# EAGLE design SensorBoard (EAGLE 9.6.2)

## Sheet 1 of 3
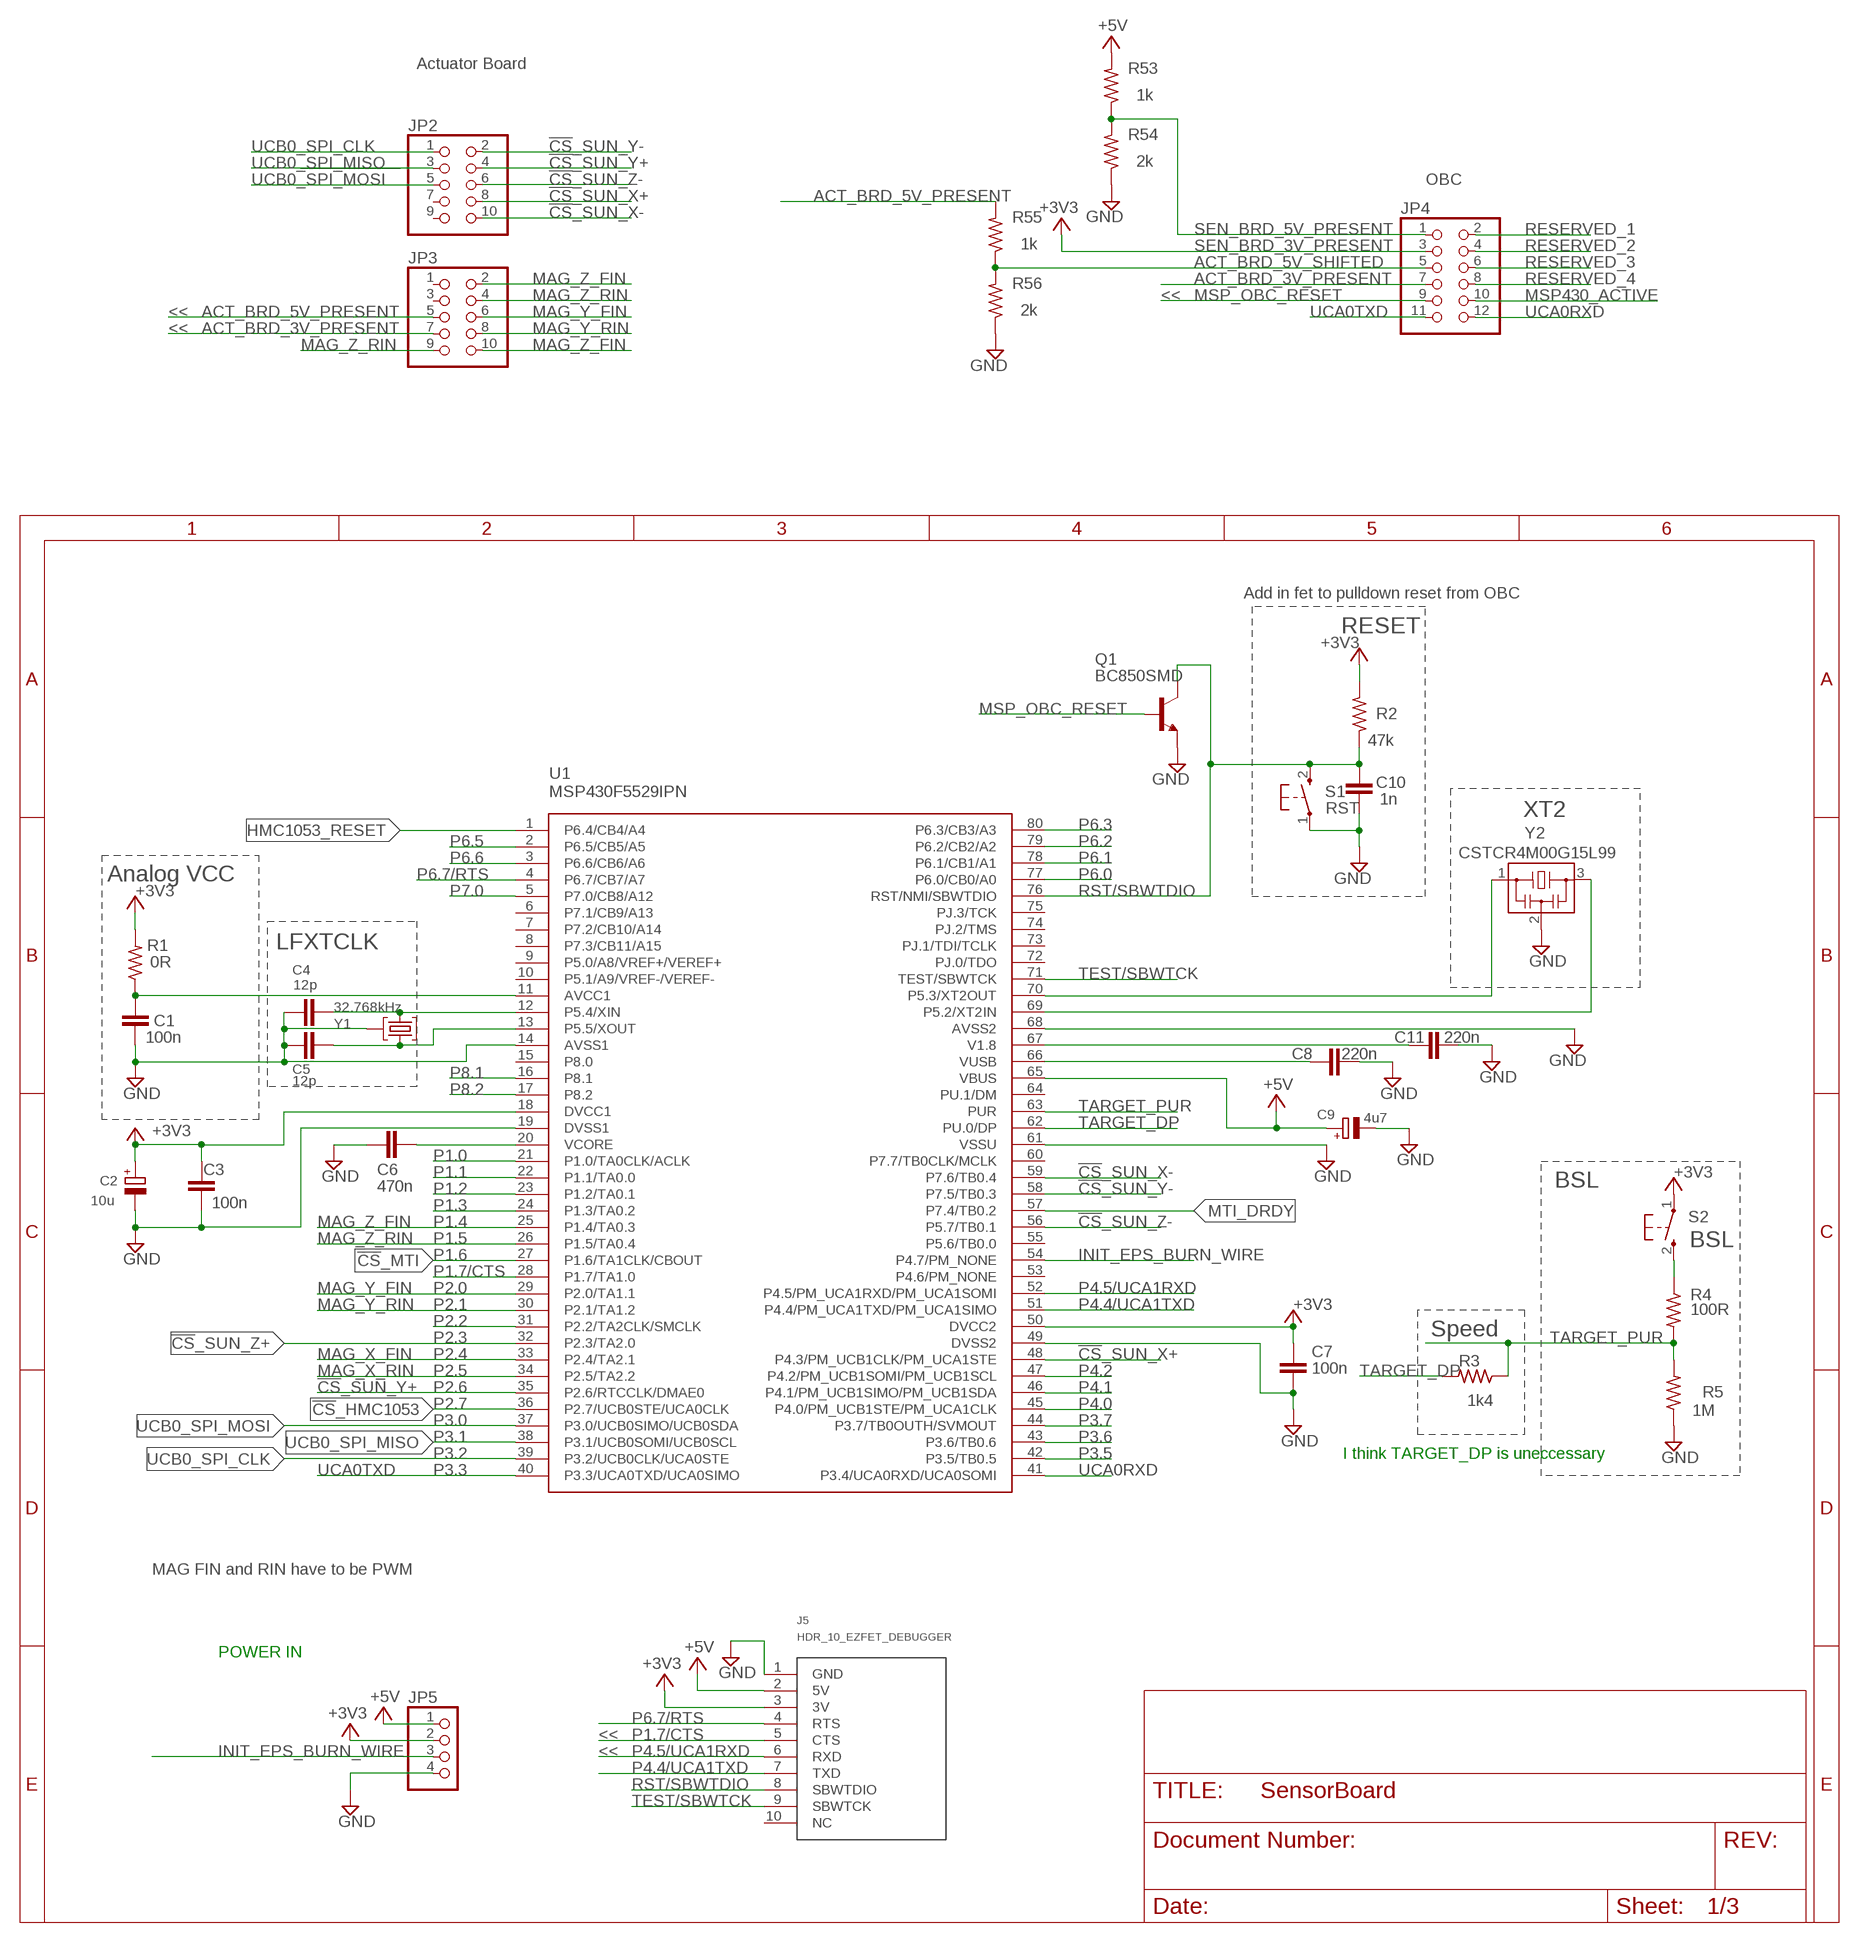
[diagram p0: schematic, sheet 1]

### Parts
C1  100n  C-EUC0402  [C0402]
C2  10u  CPOL-EUA/3216-18R  [A/3216-18R]
C3  100n  C-EUC0402  [C0402]
C4  12p  C-EUC0402  [C0402]
C5  12p  C-EUC0402  [C0402]
C6  470n  C-EUC0402  [C0402]
C7  100n  C-EUC0402  [C0402]
C8  220n  C-EUC0402  [C0402]
C9  4u7  CPOL-EUA/3216-18R  [A/3216-18R]
C10  1n  C-EUC0402  [C0402]
C11  220n  C-EUC0402  [C0402]
J5  HDR_10_EZFET_DEBUGGER  [HDRV10W66P254_10X1_2540X254H858]
JP2  PINHD-2X5  [2X05]
JP3  PINHD-2X5  [2X05]
JP4  PINHD-2X6  [2X06]
JP5  PINHD-1X4  [1X04]
Q1  BC850SMD  [SOT23-BEC]
R1  0R  R-US_R0402  [R0402]
R2  47k  R-US_R0402  [R0402]
R3  1k4  R-US_R0402  [R0402]
R4  100R  R-US_R0402  [R0402]
R5  1M  R-US_R0402  [R0402]
R53  1k  R-US_R0402  [R0402]
R54  2k  R-US_R0402  [R0402]
R55  1k  R-US_R0402  [R0402]
R56  2k  R-US_R0402  [R0402]
S1  RST  PB  [PBTH]
S2  BSL  PB  [PBTH]
U1  MSP430F5529IPN  [QFP80P50_1400X1400X160L60X22N]
Y1  32.768kHz  MS3V-T1R  [MS3V-T1R]
Y2  CSTCR4M00G15L99  CSTCR4M00G15L996M00G53Z  [MURATA-FILTER_CSTCR]

### Nets
!CS!_HMC1053: U1.36(P2.7/UCB0STE/UCA0CLK) ; also sheet 2
!CS!_MTI: U1.27(P1.6/TA1CLK/CBOUT) ; also sheet 3
!CS!_SUN_X+: JP2.10 U1.48(P4.3/PM_UCB1CLK/PM_UCA1STE)
!CS!_SUN_X-: JP2.8 U1.59(P7.6/TB0.4)
!CS!_SUN_Y+: JP2.4 U1.35(P2.6/RTCCLK/DMAE0)
!CS!_SUN_Y-: JP2.2 U1.58(P7.5/TB0.3)
!CS!_SUN_Z+: U1.32(P2.3/TA2.0)
!CS!_SUN_Z-: JP2.6 U1.56(P5.7/TB0.1)
+3V3: C2.+ C3.2 C7.1 J5.3(3V) JP4.3 JP5.2 R1.2 R2.2 S2.1(P) U1.18(DVCC1) U1.50(DVCC2) ; also sheet 2,3
+5V: C9.+ J5.2(5V) JP5.1 R53.2 U1.65(VBUS) ; also sheet 3
ACT_BRD_3V_PRESENT: JP3.7 JP4.7
ACT_BRD_5V_PRESENT: JP3.5 R55.2
ACT_BRD_5V_SHIFTED: JP4.5 R55.1 R56.2
AVCC1 [Power]: C1.1 R1.1 U1.11(AVCC1)
GND: C1.2 C2.- C3.1 C4.1 C5.1 C6.1 C7.2 C8.2 C9.- C10.2 C11.2 J5.1(GND) JP5.4 Q1.E R5.1 R54.1 R56.1 S1.1(P) U1.14(AVSS1) U1.19(DVSS1) U1.49(DVSS2) U1.61(VSSU) U1.68(AVSS2) Y1.P3(GND) Y2.2 ; also sheet 2,3
HMC1053_RESET: U1.1(P6.4/CB4/A4) ; also sheet 2
INIT_EPS_BURN_WIRE: JP5.3 U1.54(P4.7/PM_NONE)
MAG_X_FIN: U1.33(P2.4/TA2.1)
MAG_X_RIN: U1.34(P2.5/TA2.2)
MAG_Y_FIN: JP3.6 U1.29(P2.0/TA1.1)
MAG_Y_RIN: JP3.8 U1.30(P2.1/TA1.2)
MAG_Z_FIN: JP3.2 JP3.10 U1.25(P1.4/TA0.3)
MAG_Z_RIN: JP3.4 JP3.9 U1.26(P1.5/TA0.4)
MSP430_ACTIVE: JP4.10
MSP_OBC_RESET: JP4.9
MTI_DRDY: U1.57(P7.4/TB0.2) ; also sheet 3
N$1: Q1.B
N$12: R4.1 S2.2(S)
P1.0: U1.21(P1.0/TA0CLK/ACLK)
P1.1: U1.22(P1.1/TA0.0)
P1.2: U1.23(P1.2/TA0.1)
P1.3: U1.24(P1.3/TA0.2)
P1.7/CTS: J5.5(CTS) U1.28(P1.7/TA1.0)
P2.2: U1.31(P2.2/TA2CLK/SMCLK)
P3.5: U1.42(P3.5/TB0.5)
P3.6: U1.43(P3.6/TB0.6)
P3.7: U1.44(P3.7/TB0OUTH/SVMOUT)
P4.0: U1.45(P4.0/PM_UCB1STE/PM_UCA1CLK)
P4.1: U1.46(P4.1/PM_UCB1SIMO/PM_UCB1SDA)
P4.2: U1.47(P4.2/PM_UCB1SOMI/PM_UCB1SCL)
P4.4/UCA1TXD: J5.7(TXD) U1.51(P4.4/PM_UCA1TXD/PM_UCA1SIMO)
P4.5/UCA1RXD: J5.6(RXD) U1.52(P4.5/PM_UCA1RXD/PM_UCA1SOMI)
P5.2/XT2IN1: U1.69(P5.2/XT2IN) Y2.3
P5.3/XT2OUT1: U1.70(P5.3/XT2OUT) Y2.1
P5.4/XIN1: C4.2 U1.12(P5.4/XIN) Y1.P2
P5.5/XOUT1: C5.2 U1.13(P5.5/XOUT) Y1.P1
P6.0: U1.77(P6.0/CB0/A0)
P6.1: U1.78(P6.1/CB1/A1)
P6.2: U1.79(P6.2/CB2/A2)
P6.3: U1.80(P6.3/CB3/A3)
P6.5: U1.2(P6.5/CB5/A5)
P6.6: U1.3(P6.6/CB6/A6)
P6.7/RTS: J5.4(RTS) U1.4(P6.7/CB7/A7)
P7.0: U1.5(P7.0/CB8/A12)
P8.1: U1.16(P8.1)
P8.2: U1.17(P8.2)
RESERVED_1: JP4.2
RESERVED_2: JP4.4
RESERVED_3: JP4.6
RESERVED_4: JP4.8
RST/SBWTDIO: C10.1 J5.8(SBWTDIO) Q1.C R2.1 S1.2(S) U1.76(RST/NMI/SBWTDIO)
SEN_BRD_5V_PRESENT: JP4.1 R53.1 R54.2
TARGET_DP: R3.2 U1.62(PU.0/DP)
TARGET_PUR: R3.1 R4.2 R5.2 U1.63(PUR)
TARGET_VUSB1 [Power]: C8.1 U1.66(VUSB)
TEST/SBWTCK: J5.9(SBWTCK) U1.71(TEST/SBWTCK)
UCA0RXD: JP4.12 U1.41(P3.4/UCA0RXD/UCA0SOMI)
UCA0TXD: JP4.11 U1.40(P3.3/UCA0TXD/UCA0SIMO)
UCB0_SPI_CLK: JP2.1 U1.39(P3.2/UCB0CLK/UCA0STE) ; also sheet 2,3
UCB0_SPI_MISO: JP2.3 U1.38(P3.1/UCB0SOMI/UCB0SCL) ; also sheet 2,3
UCB0_SPI_MOSI: JP2.5 U1.37(P3.0/UCB0SIMO/UCB0SDA) ; also sheet 2,3
V1 [Power]: C11.1 U1.67(V1.8)
VCORE1 [Power]: C6.2 U1.20(VCORE)
Unconnected: J5.10(NC) JP2.7 JP2.9 JP3.1 JP3.3 U1.6(P7.1/CB9/A13) U1.7(P7.2/CB10/A14) U1.8(P7.3/CB11/A15) U1.9(P5.0/A8/VREF+/VEREF+) U1.10(P5.1/A9/VREF-/VEREF-) U1.15(P8.0) U1.53(P4.6/PM_NONE) U1.55(P5.6/TB0.0) U1.60(P7.7/TB0CLK/MCLK) U1.64(PU.1/DM) U1.72(PJ.0/TDO) U1.73(PJ.1/TDI/TCLK) U1.74(PJ.2/TMS) U1.75(PJ.3/TCK)

### Notes on the sheet
- Actuator Board
- OBC
- SEN_BRD_3V_PRESENT
- <<
- <<
- <<
- Add in fet to pulldown reset from OBC
- RESET
- XT2
- Analog VCC
- LFXTCLK
- BSL
- P1.4
- P1.5
- P1.6
- P2.0
- P2.1
- Speed
- P2.3
- P2.4
- P2.5
- P2.6
- P2.7
- P3.0
- P3.1
- P3.2 | I think TARGET_DP is uneccessary
- P3.3
- MAG FIN and RIN have to be PWM
- POWER IN
- <<
- <<

## Sheet 2 of 3
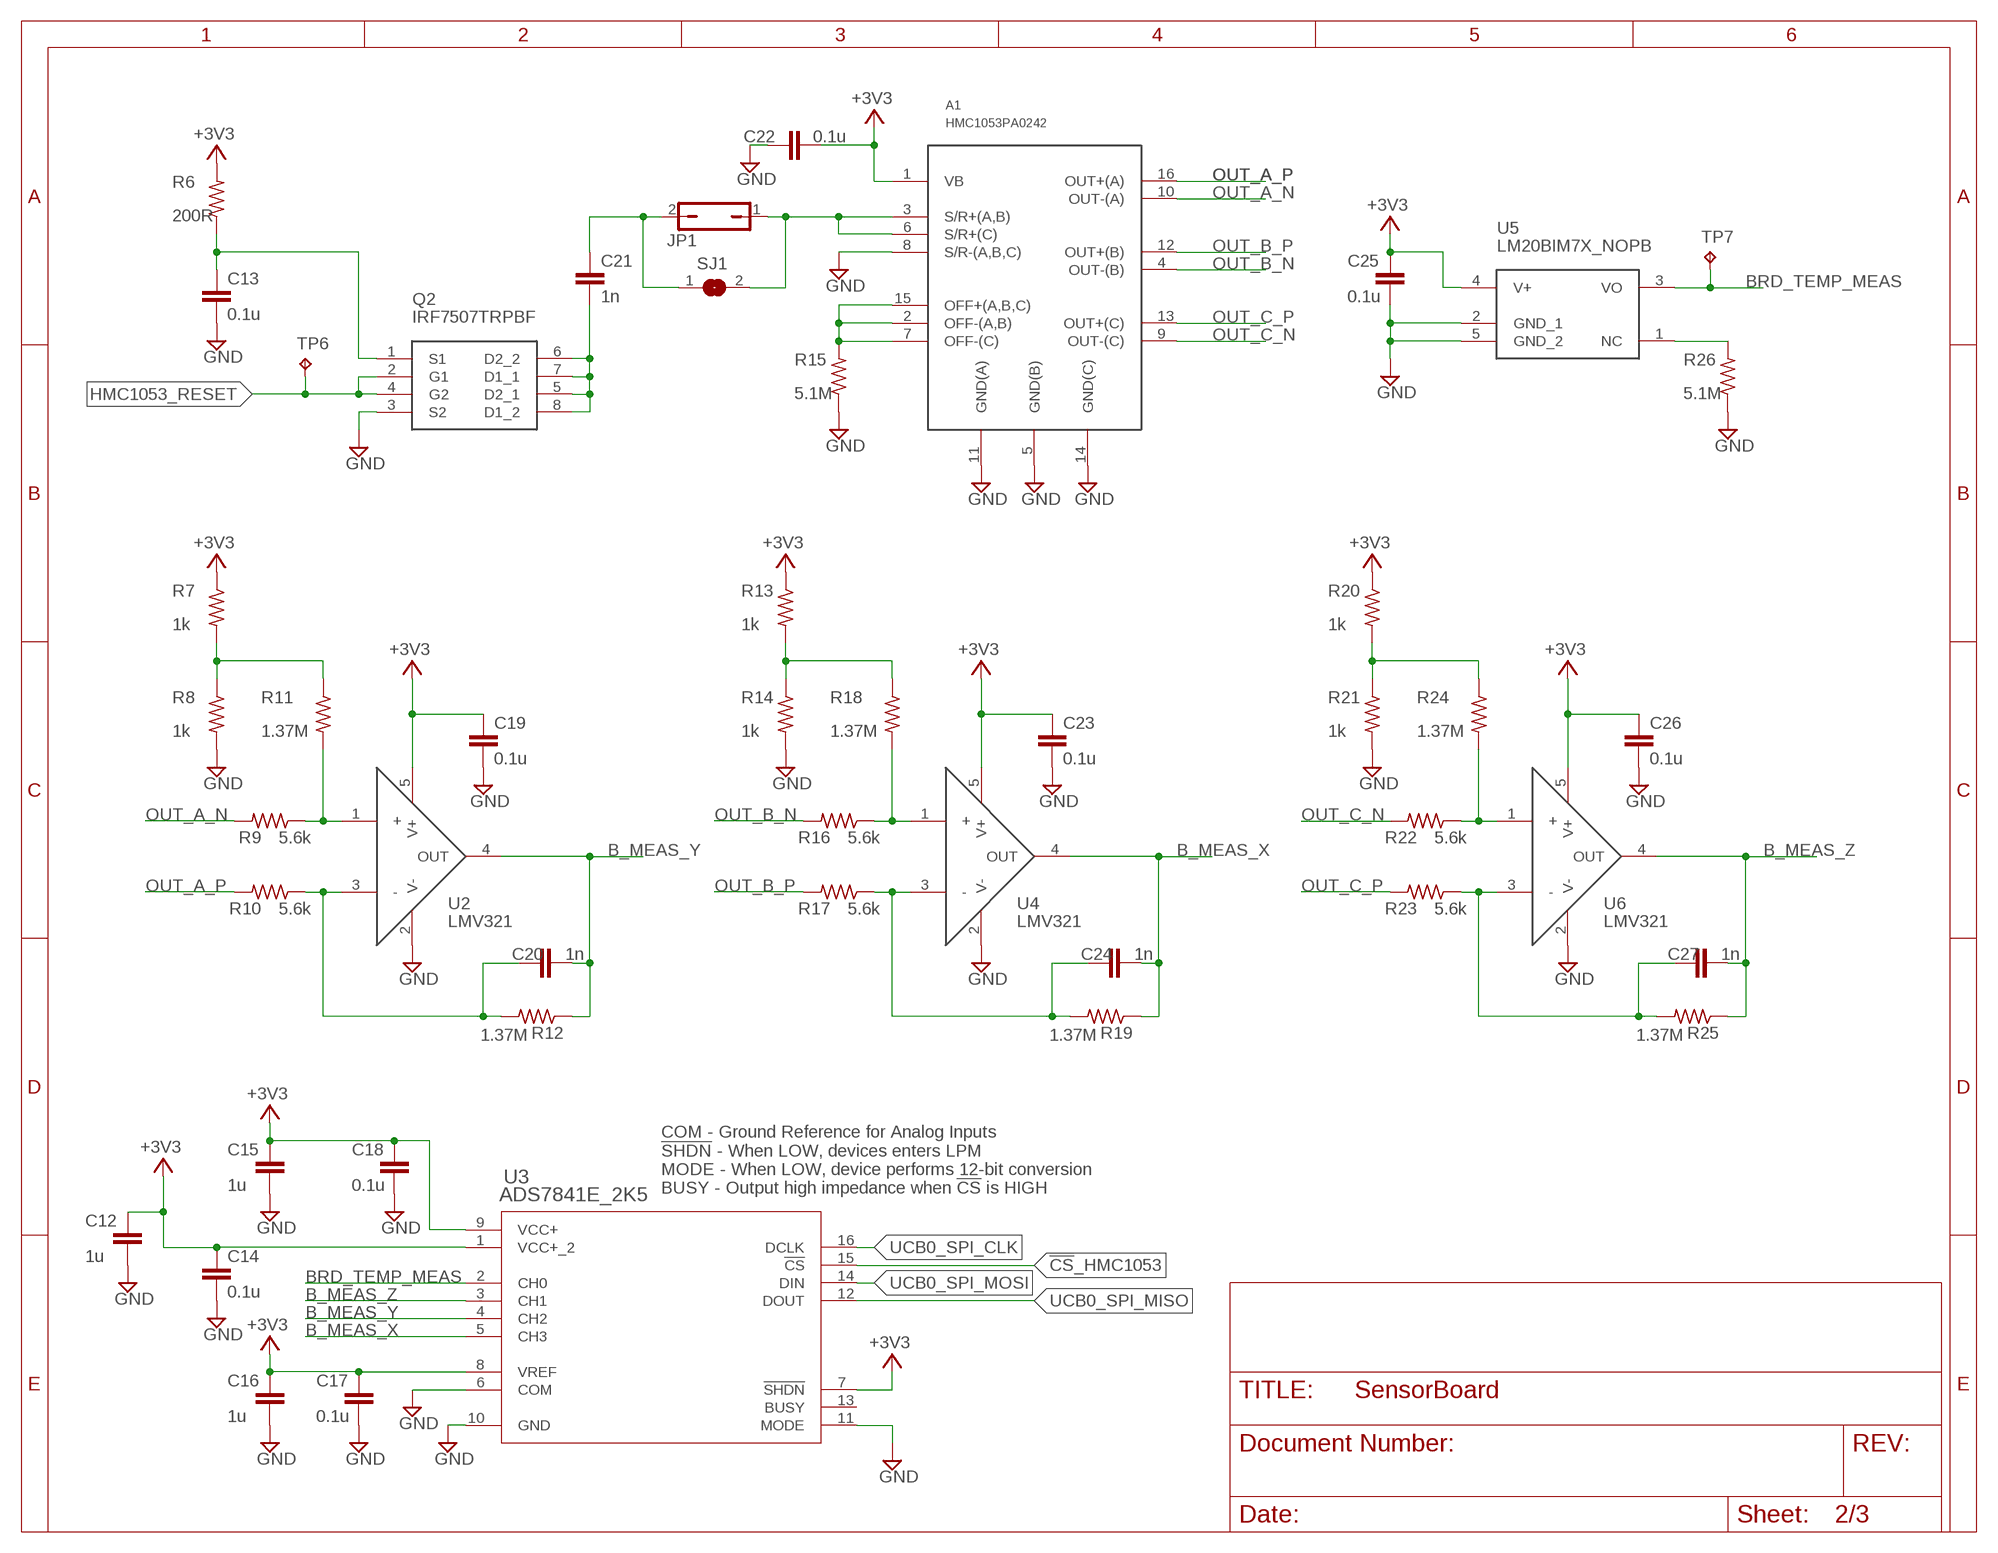
[diagram p1: schematic, sheet 2]

### Parts
A1  HMC1053PA0242  [PA0242]
C12  1u  C-EUC1206  [C1206]
C13  0.1u  C-EUC0603  [C0603]
C14  0.1u  C-EUC0603  [C0603]
C15  1u  C-EUC1206  [C1206]
C16  1u  C-EUC1206  [C1206]
C17  0.1u  C-EUC0603  [C0603]
C18  0.1u  C-EUC0603  [C0603]
C19  0.1u  C-EUC0603  [C0603]
C20  1n  C-EUC0805  [C0805]
C21  1n  C-EUC1206  [C1206]
C22  0.1u  C-EUC0603  [C0603]
C23  0.1u  C-EUC0603  [C0603]
C24  1n  C-EUC0805  [C0805]
C25  0.1u  C-EUC0603  [C0603]
C26  0.1u  C-EUC0603  [C0603]
C27  1n  C-EUC0805  [C0805]
JP1  JP1Q  [JP1]
Q2  IRF7507TRPBF  [SOP8P65_300X490X111L53X30N]
R6  200R  R-US_R1206  [R1206]
R7  1k  R-US_R0805  [R0805]
R8  1k  R-US_R0805  [R0805]
R9  5.6k  R-US_R0805  [R0805]
R10  5.6k  R-US_R0805  [R0805]
R11  1.37M  R-US_R0805  [R0805]
R12  1.37M  R-US_R0805  [R0805]
R13  1k  R-US_R0805  [R0805]
R14  1k  R-US_R0805  [R0805]
R15  5.1M  R-US_R1206  [R1206]
R16  5.6k  R-US_R0805  [R0805]
R17  5.6k  R-US_R0805  [R0805]
R18  1.37M  R-US_R0805  [R0805]
R19  1.37M  R-US_R0805  [R0805]
R20  1k  R-US_R0805  [R0805]
R21  1k  R-US_R0805  [R0805]
R22  5.6k  R-US_R0805  [R0805]
R23  5.6k  R-US_R0805  [R0805]
R24  1.37M  R-US_R0805  [R0805]
R25  1.37M  R-US_R0805  [R0805]
R26  5.1M  R-US_R1206  [R1206]
SJ1  SJ  [SJ]
TP6  TPPAD1-13  [P1-13]
TP7  TPB1,27  [B1,27]
U2  LMV321  [SOT23-5P65_210X110L36X22N]
U3  ADS7841E_2K5  [DBQ16]
U4  LMV321  [SOT23-5P65_210X110L36X22N]
U5  LM20BIM7X_NOPB  [SOT23-5P65_210X110L40X22N_LM20]
U6  LMV321  [SOT23-5P65_210X110L36X22N]

### Nets
!CS!_HMC1053: U3.15(!CS) ; also sheet 1
+3V3: A1.1(VB) C12.1 C14.1 C15.1 C16.1 C17.1 C18.1 C19.1 C22.1 C23.1 C25.2 C26.1 R6.2 R7.1 R13.1 R20.1 U2.5(V+) U3.1(VCC+_2) U3.7(!SHDN) U3.8(VREF) U3.9(VCC+) U4.5(V+) U5.4(V+) U6.5(V+) ; also sheet 1,3
B_MEAS_X: C24.2 R19.1 U3.5(CH3) U4.4(OUT)
B_MEAS_Y: C20.2 R12.1 U2.4(OUT) U3.4(CH2)
B_MEAS_Z: C27.2 R25.1 U3.3(CH1) U6.4(OUT)
BRD_TEMP_MEAS: TP7.TP U3.2(CH0) U5.3(VO)
GND: A1.5(GND(B)) A1.8(S/R-(A,B,C)) A1.11(GND(A)) A1.14(GND(C)) C12.2 C13.1 C14.2 C15.2 C16.2 C17.2 C18.2 C19.2 C22.2 C23.2 C25.1 C26.2 Q2.3(S2) R8.2 R14.2 R15.1 R21.2 R26.1 U2.2(V-) U3.6(COM) U3.10(GND) U3.11(MODE) U4.2(V-) U5.2(GND_1) U5.5(GND_2) U6.2(V-) ; also sheet 1,3
HMC1053_RESET: Q2.2(G1) Q2.4(G2) TP6.TP ; also sheet 1
N$20: R7.2 R8.1 R11.1
N$21: C20.1 R10.1 R12.2 U2.3(-)
N$23: R9.1 R11.2 U2.1(+)
N$35: C21.2 JP1.2 SJ1.1
N$36: A1.2(OFF-(A,B)) A1.7(OFF-(C)) A1.15(OFF+(A,B,C)) R15.2
N$37: A1.3(S/R+(A,B)) A1.6(S/R+(C)) JP1.1 SJ1.2
N$38: C21.1 Q2.5(D2_1) Q2.6(D2_2) Q2.7(D1_1) Q2.8(D1_2)
N$39: C13.2 Q2.1(S1) R6.1
N$40: R26.2 U5.1(NC)
N$49: R13.2 R14.1 R18.1
N$50: C24.1 R17.1 R19.2 U4.3(-)
N$52: R16.1 R18.2 U4.1(+)
N$59: R20.2 R21.1 R24.1
N$60: C27.1 R23.1 R25.2 U6.3(-)
N$62: R22.1 R24.2 U6.1(+)
OUT_A_N: A1.10(OUT-(A)) R9.2
OUT_A_P: A1.16(OUT+(A)) R10.2
OUT_B_N [Ground]: A1.4(OUT-(B)) R16.2
OUT_B_P [Ground]: A1.12(OUT+(B)) R17.2
OUT_C_N [Ground]: A1.9(OUT-(C)) R22.2
OUT_C_P [Ground]: A1.13(OUT+(C)) R23.2
UCB0_SPI_CLK: U3.16(DCLK) ; also sheet 1,3
UCB0_SPI_MISO: U3.12(DOUT) ; also sheet 1,3
UCB0_SPI_MOSI: U3.14(DIN) ; also sheet 1,3
Unconnected: U3.13(BUSY)

### Notes on the sheet
- COM - Ground Reference for Analog Inputs
  !SHDN! - When LOW, devices enters LPM
  MODE - When LOW, device performs 12-bit conversion
  BUSY - Output high impedance when !CS! is HIGH

## Sheet 3 of 3
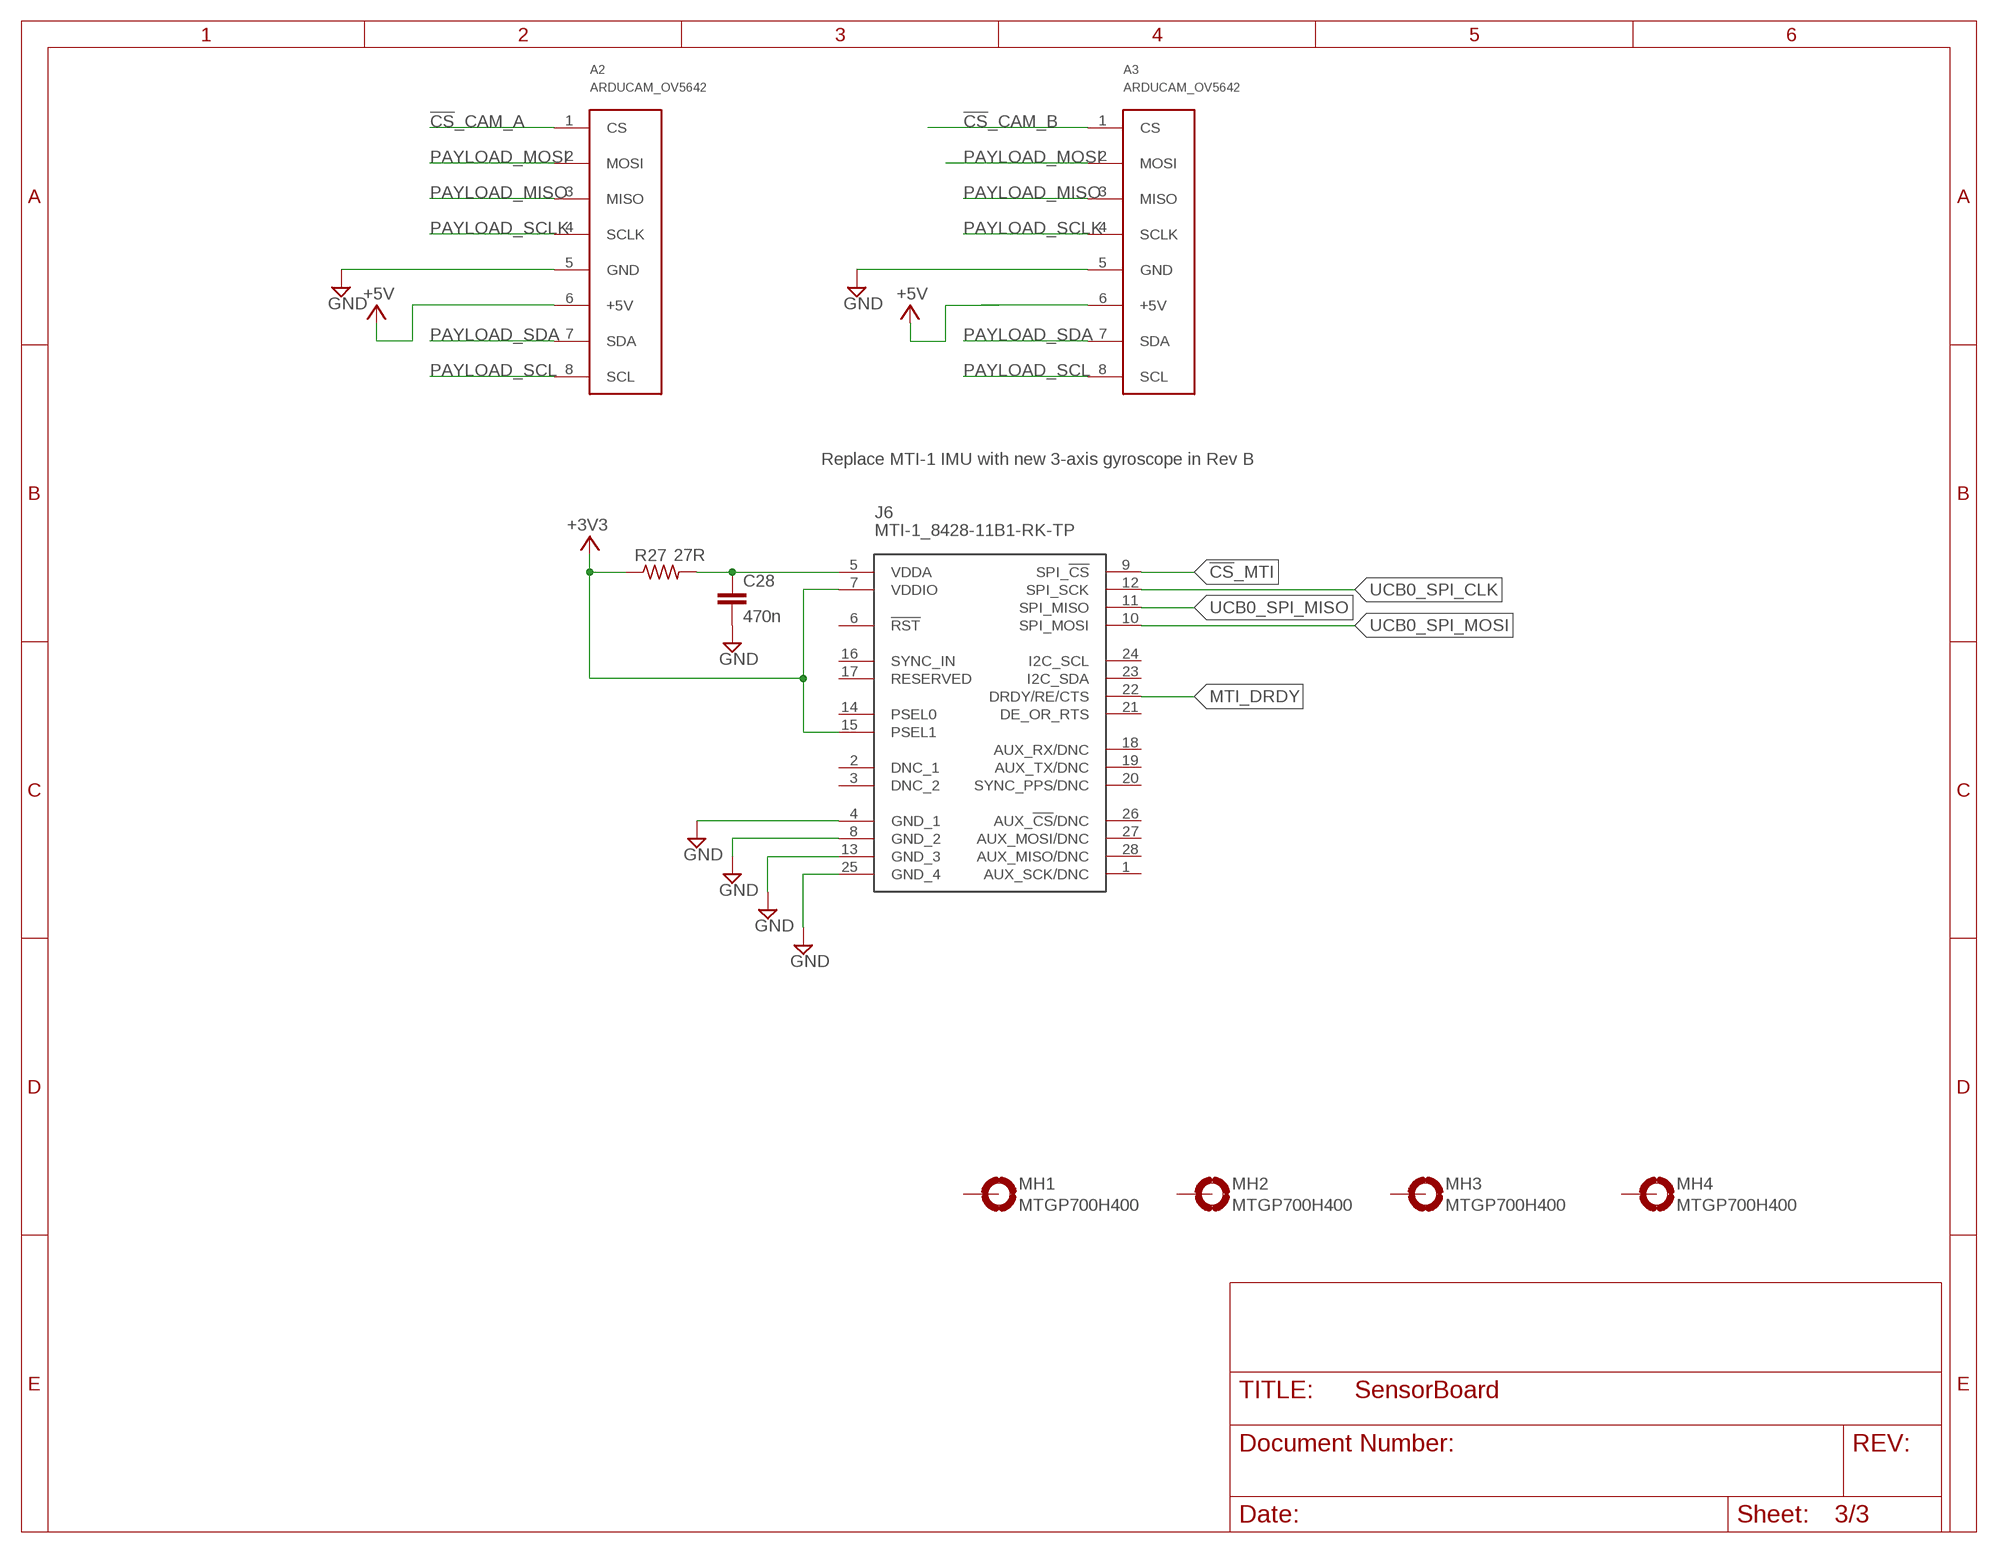
[diagram p2: schematic, sheet 3]

### Parts
A2  ARDUCAM_OV5642  [ARDUCAM]
A3  ARDUCAM_OV5642  [ARDUCAM]
C28  470n  C-EUC0805  [C0805]
J6  MTI-1_8428-11B1-RK-TP  [PLCC-28_SOCKET_TH]
MH1  MTGP700H400  [MTGP700H400]
MH2  MTGP700H400  [MTGP700H400]
MH3  MTGP700H400  [MTGP700H400]
MH4  MTGP700H400  [MTGP700H400]
R27  27R  R-US_R0805  [R0805]

### Nets
!CS!_CAM_A: A2.1(CS)
!CS!_CAM_B: A3.1(CS)
!CS!_MTI: J6.9(SPI_!CS) ; also sheet 1
+3V3: J6.7(VDDIO) J6.15(PSEL1) R27.1 ; also sheet 1,2
+5V: A2.6(+5V) ; also sheet 1
GND: A2.5(GND) A3.5(GND) C28.1 J6.4(GND_1) J6.8(GND_2) J6.13(GND_3) J6.25(GND_4) ; also sheet 1,2
MTI_DRDY: J6.22(DRDY/RE/CTS) ; also sheet 1
N$7: C28.2 J6.5(VDDA) R27.2
N$17: A3.6(+5V)
PAYLOAD_MISO: A2.3(MISO) A3.3(MISO)
PAYLOAD_MOSI: A2.2(MOSI) A3.2(MOSI)
PAYLOAD_SCL: A2.8(SCL) A3.8(SCL)
PAYLOAD_SCLK: A2.4(SCLK) A3.4(SCLK)
PAYLOAD_SDA: A2.7(SDA) A3.7(SDA)
UCB0_SPI_CLK: J6.12(SPI_SCK) ; also sheet 1,2
UCB0_SPI_MISO: J6.11(SPI_MISO) ; also sheet 1,2
UCB0_SPI_MOSI: J6.10(SPI_MOSI) ; also sheet 1,2
Unconnected: J6.1(AUX_SCK/DNC) J6.2(DNC_1) J6.3(DNC_2) J6.6(!RST) J6.14(PSEL0) J6.16(SYNC_IN) J6.17(RESERVED) J6.18(AUX_RX/DNC) J6.19(AUX_TX/DNC) J6.20(SYNC_PPS/DNC) J6.21(DE_OR_RTS) J6.23(I2C_SDA) J6.24(I2C_SCL) J6.26(AUX_!CS!/DNC) J6.27(AUX_MOSI/DNC) J6.28(AUX_MISO/DNC) MH1.1(MOUNT) MH2.1(MOUNT) MH3.1(MOUNT) MH4.1(MOUNT)

### Notes on the sheet
- Replace MTI-1 IMU with new 3-axis gyroscope in Rev B

## Library data of the parts
A1 = my_library:HMC1053
A2 A3 = my_library:ARDUCAM_OV5642
C1 C3-C8 C10 C11 C13 C14 C17-C20 C22-C28 = rcl:C-EU: CAPACITOR, European symbol; SPICEPREFIX: C
C2 C9 = rcl:CPOL-EU: POLARIZED CAPACITOR, European symbol
C12 C15 C16 C21 = resistor:C-EU: CAPACITOR, European symbol
J5 = my_library:HDR_10_EZFET_DEBUGGER
J6 = my_library:MTI-1
JP1 = jumper:JP1Q: JUMPER
JP2 JP3 = pinhead:PINHD-2X5: PIN HEADER
JP4 = pinhead:PINHD-2X6: PIN HEADER
JP5 = pinhead:PINHD-1X4: PIN HEADER
MH1-MH4 = my_library:MTGP700H400
Q1 = transistor-npn:BC850*: NPN Transistor
Q2 = my_library:IRF7507TRPBF
R1-R5 R7-R14 R16-R25 R27 R53-R56 = rcl:R-US_: RESISTOR, American symbol; SPICEPREFIX: R
R6 R15 R26 = resistor:R-US_: RESISTOR, American symbol
S1 S2 = electricalmeter:PB: OMRON SWITCH
SJ1 = jumper:SJ: SMD solder JUMPER
TP6 TP7 = testpad:TP: Test pad
U1 = my_library:MSP430F5529IPN
U2 U4 U6 = my_library:LMV321
U3 = my_library:ADS7841E_2K5; DATASHEET_URL: http://www.ti.com/lit/gpn/ADS7841; DESCRIPTION: 12-Bit, 4-Channel Serial Output Sampling Analog-to-Digital Converter; FAMILY_NAME: PRECISION ADC (<=10MSPS); GENERIC_PART_NUMBER: ADS7841; INDUSTRY_STD_PKG_TYPE: SSOP/QSOP; MANUFACTURER: Texas Instruments; PACKAGE_DESIGNATOR: DBQ; PIN_COUNT: 16
U5 = my_library:LM20BIM7X_NOPB
Y1 = my_library:MS3V-T1R
Y2 = my_library:CSTCR4M00G15L99; MPN: CSTCR6M00G53-R0; OC_FARNELL: 1170434; OC_NEWARK: 25M8759

## Net classes
0 Default: width 0.203 mm, drill 0.305 mm, clearance 0.152 mm
1 Ground: width 0.203 mm, drill 0.305 mm, clearance 0.152 mm to class 0, clearance 0.152 mm
2 Power: width 0.203 mm, drill 0.305 mm, clearance 0.152 mm to class 0, clearance 0.152 mm to class 1, clearance 0.152 mm

## Board
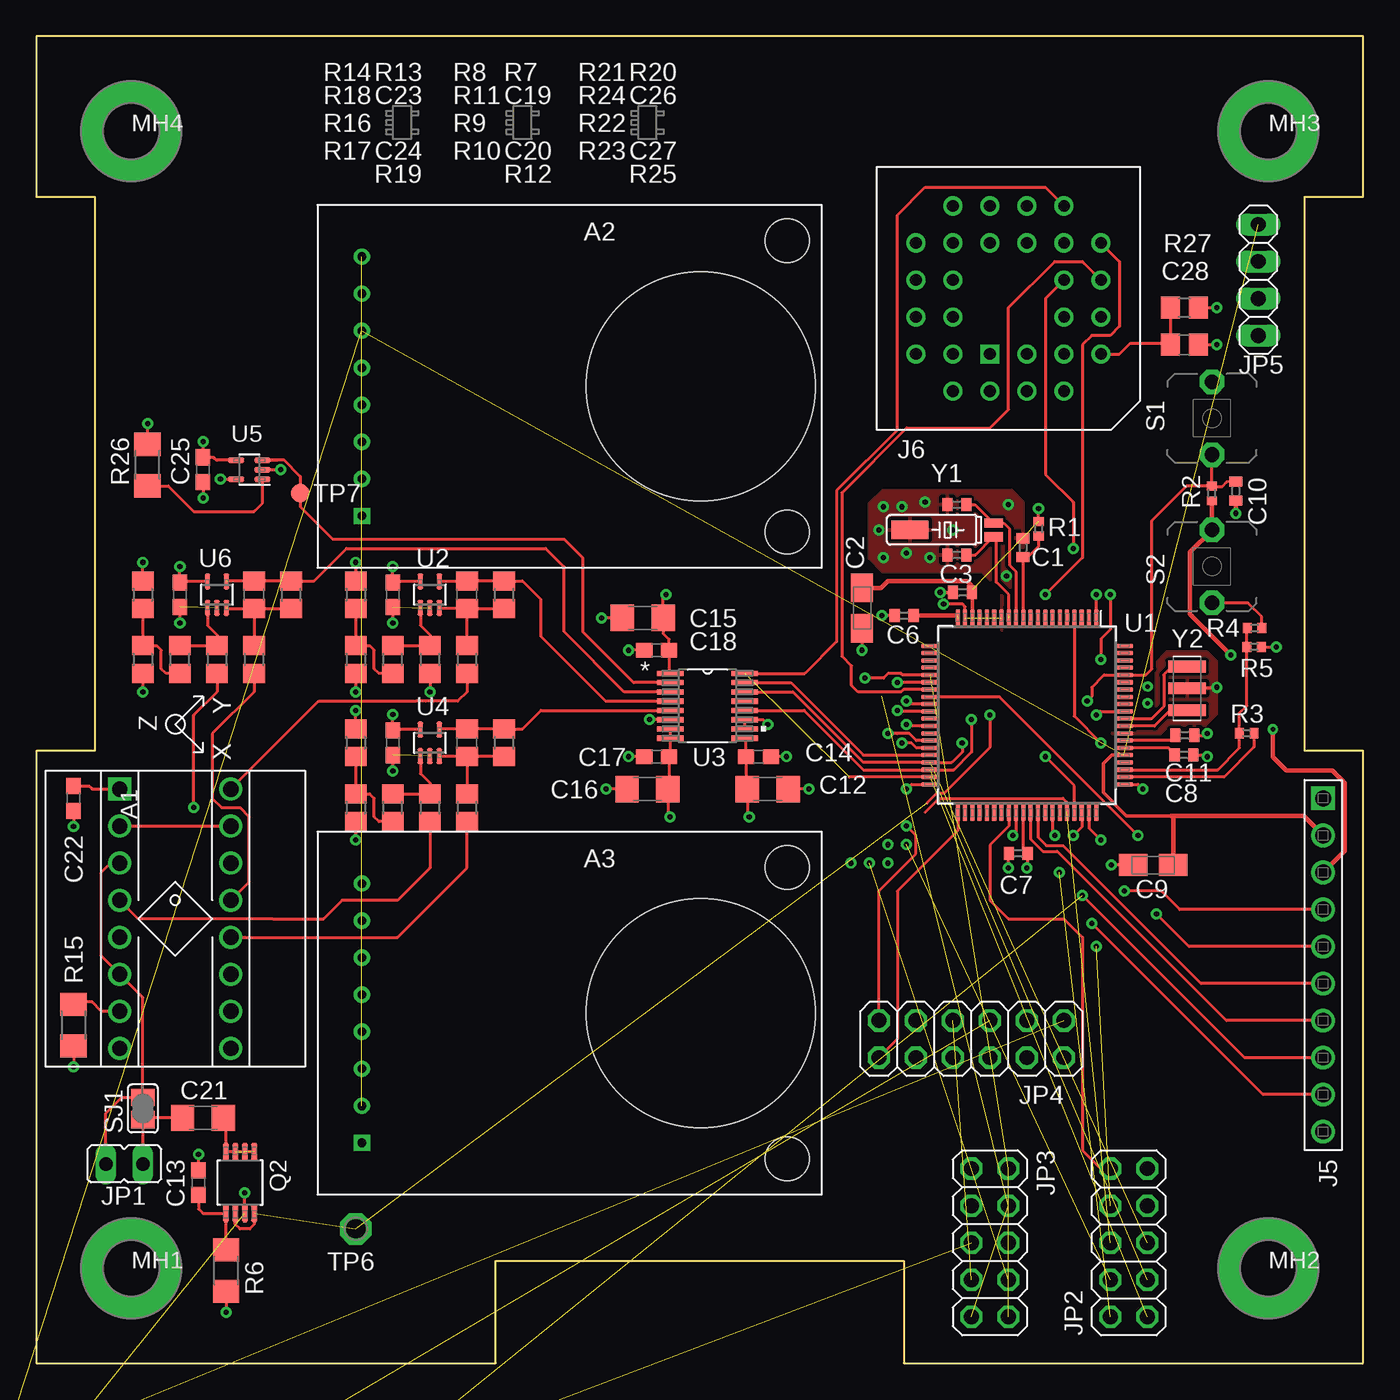
[diagram p3: board, top side]
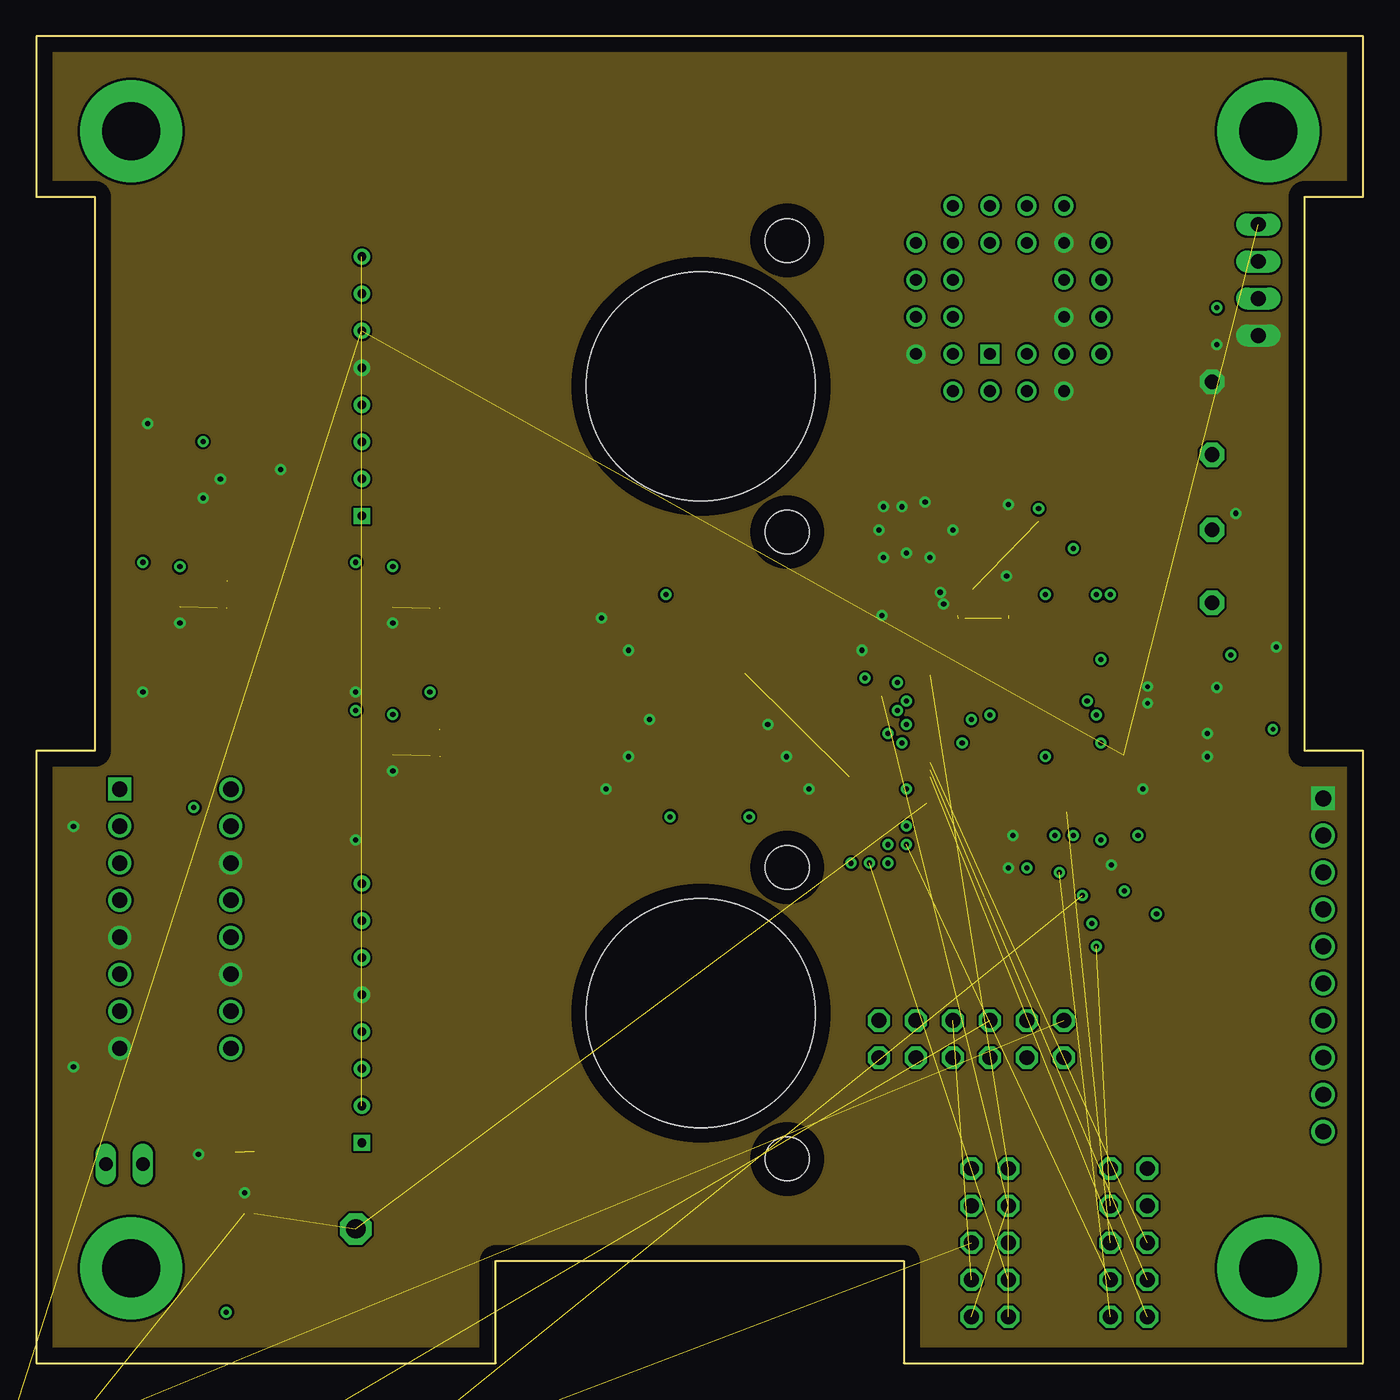
[diagram p4: board, inner layer GND]
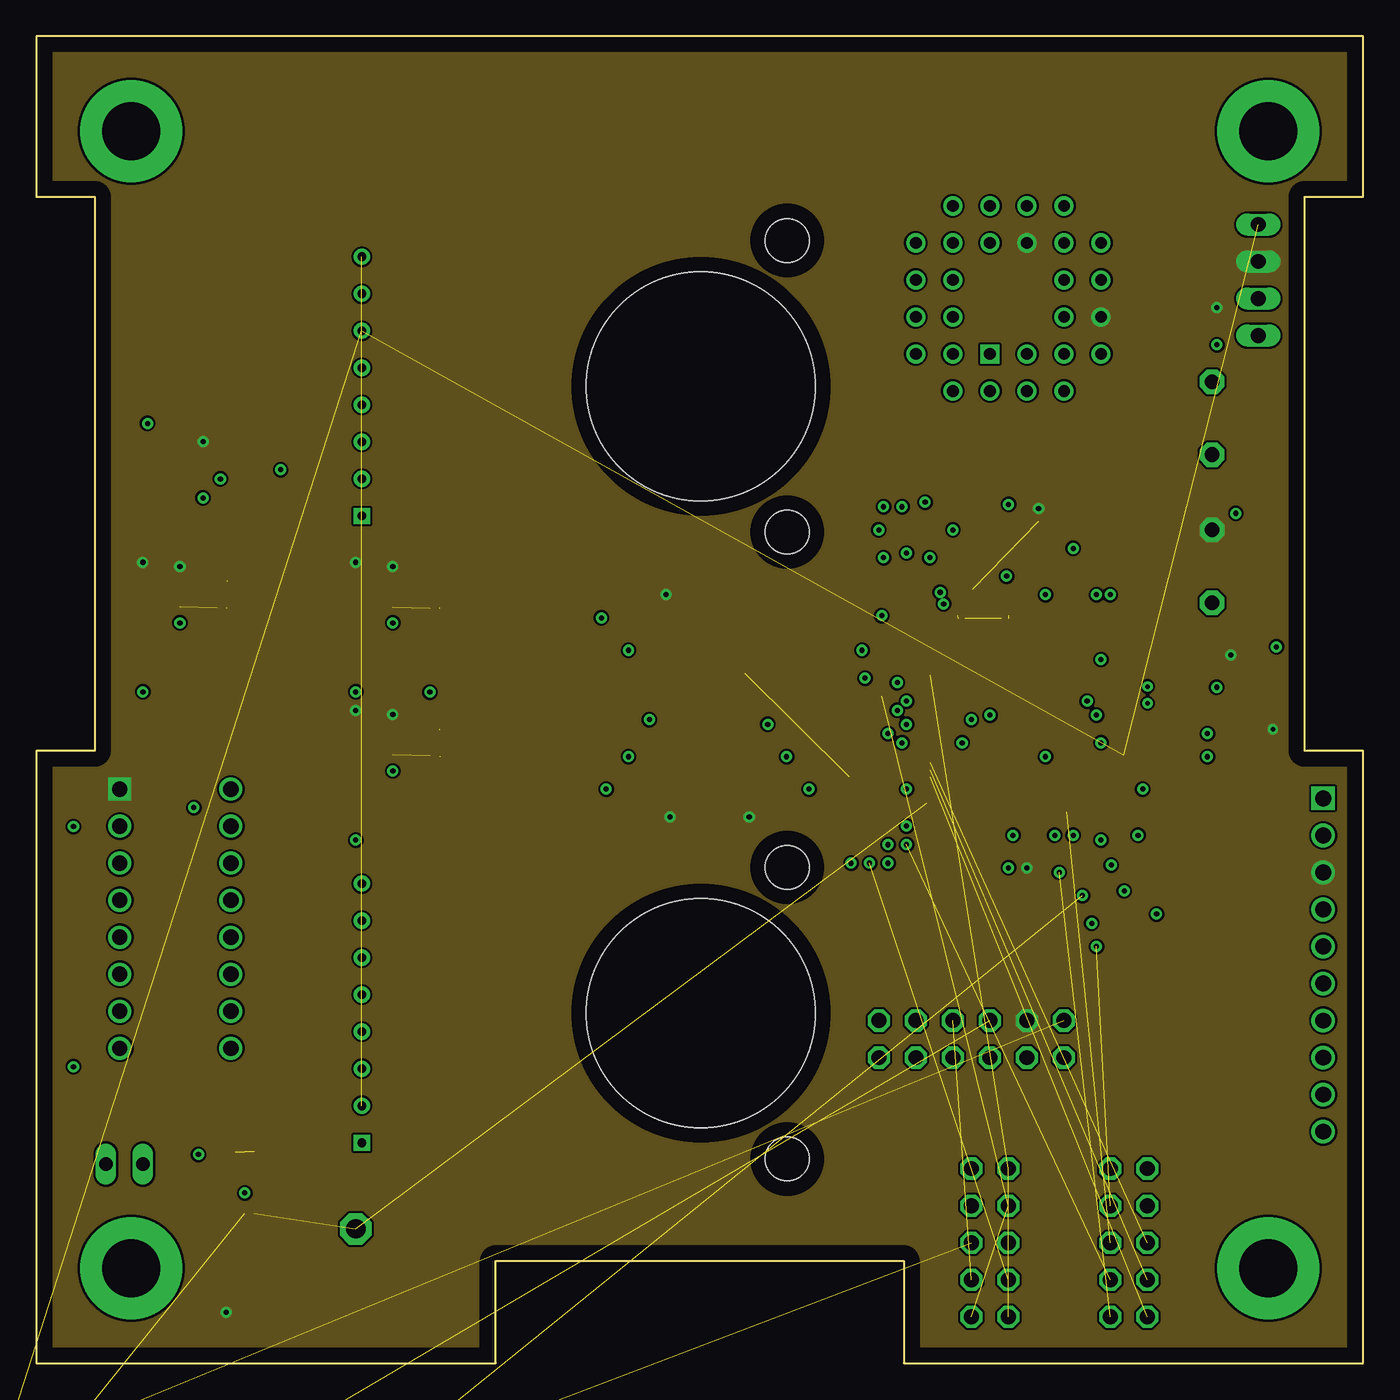
[diagram p5: board, inner layer PWR]
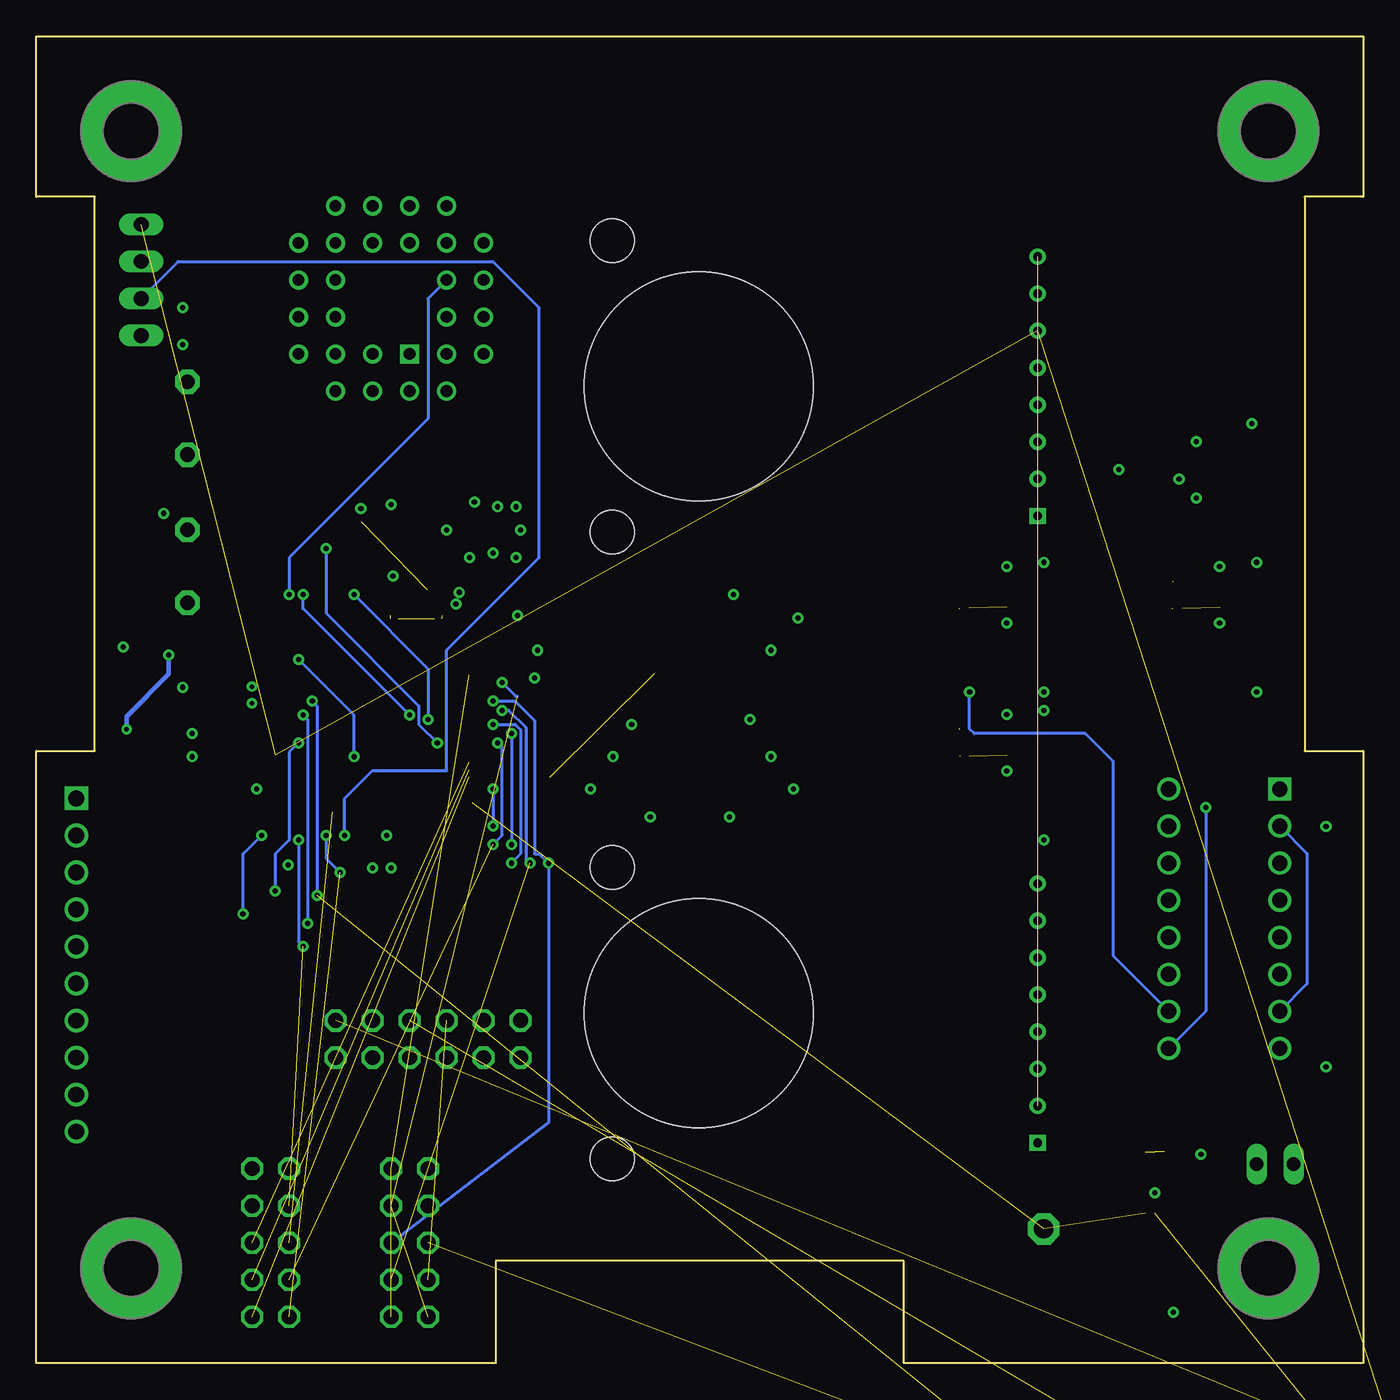
[diagram p6: board, bottom side, seen from below]

Size 91 x 91 mm. Coordinates in mm from the lower left corner, seen from the top.
Outline: 0,0 31.5,0 31.5,7 59.5,7 59.5,0 91,0 91,42 87,42 87,80 91,80 91,91 0,91 0,80 4,80 4,42 0,42 0,0
Copper layers (1+2*15+16): Top 0.035mm / dielectric 1.5mm / GND 0.035mm / dielectric 0.15mm / PWR 0.035mm / dielectric 0.2mm / Bottom 0.035mm
Design rules "default *": minimum track width 6mil, minimum drill 0.35mm, track to track 6mil, track to pad 6mil, pad to pad 6mil, via to via 6mil, smd to smd 6mil, copper to edge 40mil, drill to drill 6mil, minimum pad ring 10mil, minimum via ring 8mil, stop-mask expansion 4mil, vias tented up to drill 0mil, thermal gap 10mil

### Footprints (pad centres in the part's own frame; a part is rotated, then mirrored left to right if it is on the bottom)
PA0242 = drill 1.05 square: 1 0,0 | drill 1.05: 2 2.54,0; 3 5.08,0; 4 7.62,0; 5 10.16,0; 6 12.7,0; 7 15.24,0; 8 17.78,0; 9 17.78,7.62; 10 15.24,7.62; 11 12.7,7.62; 12 10.16,7.62; 13 7.62,7.62; 14 5.08,7.62; 15 2.54,7.62; 16 0,7.62
ARDUCAM = drill 0.6 square: 1 -29.18,-18.89 | drill 0.6: 2 -29.18,-16.35; 3 -29.18,-13.81; 4 -29.18,-11.27; 5 -29.18,-8.73; 6 -29.18,-6.19; 7 -29.18,-3.65; 8 -29.18,-1.11 | hole 3: 0,0; 0,-20 | hole 15.7: -5.917,-10
C0402 = smd 0.7 x 0.9: 1 -0.65,0; 2 0.65,0
A/3216-18R = smd 1.95 x 1.5: + 1.375,0; - -1.375,0
C1206 = smd 1.6 x 1.8: 1 -1.4,0; 2 1.4,0
C0603 = smd 1.1 x 1: 1 -0.85,0; 2 0.85,0
C0805 = smd 1.3 x 1.5: 1 -0.95,0; 2 0.95,0
HDRV10W66P254_10X1_2540X254H858 = drill 1.08 pad 1.62 square: 1 0,0 | drill 1.08 pad 1.62: 2 2.54,0; 3 5.08,0; 4 7.62,0; 5 10.16,0; 6 12.7,0; 7 15.24,0; 8 17.78,0; 9 20.32,0; 10 22.86,0
PLCC-28_SOCKET_TH = drill 0.8 square: 1 0,0 | drill 0.8: 2 -2.54,2.54; 3 -2.54,0; 4 -5.08,2.54; 5 -7.62,0; 6 -5.08,0; 7 -7.62,-2.54; 8 -5.08,-2.54; 9 -7.62,-5.08; 10 -5.08,-5.08; 11 -7.62,-7.62; 12 -5.08,-10.16; 13 -5.08,-7.62; 14 -2.54,-10.16; 15 -2.54,-7.62; 16 0,-10.16; 17 0,-7.62; 18 2.54,-10.16; 19 5.08,-7.62; 20 2.54,-7.62; 21 5.08,-5.08; 22 2.54,-5.08; 23 5.08,-2.54; 24 2.54,-2.54; 25 5.08,0; 26 2.54,2.54; 27 2.54,0; 28 0,2.54
JP1 = drill 0.914 long: 1 0,-1.27; 2 0,1.27
2X05 = drill 1.016 octagon: 1 -5.08,-1.27; 2 -5.08,1.27; 3 -2.54,-1.27; 4 -2.54,1.27; 5 0,-1.27; 6 0,1.27; 7 2.54,-1.27; 8 2.54,1.27; 9 5.08,-1.27; 10 5.08,1.27
2X06 = drill 1.016 octagon: 1 -6.35,-1.27; 2 -6.35,1.27; 3 -3.81,-1.27; 4 -3.81,1.27; 5 -1.27,-1.27; 6 -1.27,1.27; 7 1.27,-1.27; 8 1.27,1.27; 9 3.81,-1.27; 10 3.81,1.27; 11 6.35,-1.27; 12 6.35,1.27
1X04 = drill 1.016 long: 1 -3.81,0; 2 -1.27,0; 3 1.27,0; 4 3.81,0
MTGP700H400 = drill 4 pad 7: 1 0,0
SOT23-BEC = smd 1 x 1.4: B -0.95,-1.1; C 0,1.1; E 0.95,-1.1
SOP8P65_300X490X111L53X30N = smd 0.45 x 1.22: 1 -0.975,-2.115; 2 -0.325,-2.115; 3 0.325,-2.115; 4 0.975,-2.115; 5 0.975,2.115; 6 0.325,2.115; 7 -0.325,2.115; 8 -0.975,2.115
R0402 = smd 0.6 x 0.7: 1 -0.5,0; 2 0.5,0
R1206 = smd 1.6 x 1.803: 1 -1.422,0; 2 1.422,0
R0805 = smd 1.3 x 1.5: 1 -0.95,0; 2 0.95,0
PBTH = drill 1.016 pad 1.676 octagon: 1 -0.001,0.001; 2 5.001,0.001
SJ = smd 1.168 x 1.6: 1 -0.762,0; 2 0.762,0
P1-13 = drill 1.321 pad 2.159 octagon: TP 0,0
B1,27 = smd 1.27 x 1.27: TP 0,0
QFP80P50_1400X1400X160L60X22N = smd 0.3 x 1.26: 1 -4.75,-6.63; 2 -4.25,-6.63; 3 -3.75,-6.63; 4 -3.25,-6.63; 5 -2.75,-6.63; 6 -2.25,-6.63; 7 -1.75,-6.63; 8 -1.25,-6.63; 9 -0.75,-6.63; 10 -0.25,-6.63; 11 0.25,-6.63; 12 0.75,-6.63; 13 1.25,-6.63; 14 1.75,-6.63; 15 2.25,-6.63; 16 2.75,-6.63; 17 3.25,-6.63; 18 3.75,-6.63; 19 4.25,-6.63; 20 4.75,-6.63; 41 4.75,6.63; 42 4.25,6.63; 43 3.75,6.63; 44 3.25,6.63; 45 2.75,6.63; 46 2.25,6.63; 47 1.75,6.63; 48 1.25,6.63; 49 0.75,6.63; 50 0.25,6.63; 51 -0.25,6.63; 52 -0.75,6.63; 53 -1.25,6.63; 54 -1.75,6.63; 55 -2.25,6.63; 56 -2.75,6.63; 57 -3.25,6.63; 58 -3.75,6.63; 59 -4.25,6.63; 60 -4.75,6.63 | smd 1.26 x 0.3: 21 6.63,-4.75; 22 6.63,-4.25; 23 6.63,-3.75; 24 6.63,-3.25; 25 6.63,-2.75; 26 6.63,-2.25; 27 6.63,-1.75; 28 6.63,-1.25; 29 6.63,-0.75; 30 6.63,-0.25; 31 6.63,0.25; 32 6.63,0.75; 33 6.63,1.25; 34 6.63,1.75; 35 6.63,2.25; 36 6.63,2.75; 37 6.63,3.25; 38 6.63,3.75; 39 6.63,4.25; 40 6.63,4.75; 61 -6.63,4.75; 62 -6.63,4.25; 63 -6.63,3.75; 64 -6.63,3.25; 65 -6.63,2.75; 66 -6.63,2.25; 67 -6.63,1.75; 68 -6.63,1.25; 69 -6.63,0.75; 70 -6.63,0.25; 71 -6.63,-0.25; 72 -6.63,-0.75; 73 -6.63,-1.25; 74 -6.63,-1.75; 75 -6.63,-2.25; 76 -6.63,-2.75; 77 -6.63,-3.25; 78 -6.63,-3.75; 79 -6.63,-4.25; 80 -6.63,-4.75
SOT23-5P65_210X110L36X22N = smd 0.38 x 1.09: 1 -0.65,-0.91; 2 0,-0.91; 3 0.65,-0.91; 4 0.65,0.91; 5 -0.65,0.91
DBQ16 = smd 1.803 x 0.356: 1 -2.553,2.223; 2 -2.553,1.587; 3 -2.553,0.953; 4 -2.553,0.318; 5 -2.553,-0.318; 6 -2.553,-0.953; 7 -2.553,-1.587; 8 -2.553,-2.223; 9 2.553,-2.223; 10 2.553,-1.587; 11 2.553,-0.953; 12 2.553,-0.318; 13 2.553,0.318; 14 2.553,0.953; 15 2.553,1.587; 16 2.553,2.223
SOT23-5P65_210X110L40X22N_LM20 = smd 0.38 x 1.11: 1 -0.65,-0.9; 2 0,-0.9; 3 0.65,-0.9; 4 0.65,0.9; 5 -0.65,0.9
MS3V-T1R = smd 0.635 x 1.27: P1 -0.47,-4.43; P2 0.47,-4.43 | smd 1.27 x 2.54: P3 0,1.3
MURATA-FILTER_CSTCR = smd 0.8 x 2.6: 1 -1.5,0; 2 0,0; 3 1.5,0

### Placement (x,y rotation side)
A1  5.71,39.37 270 top
A2  51.5,77 0 top
A3  51.5,34 0 top
C1  67.68,55.93 90 top
C2  56.63,51.79 90 top
C3  63.53,52.87 0 top
C4  63.13,58.88 0 top
C5  63.13,55.44 0 top
C6  59.52,51.27 0 top
C7  67.35,34.96 180 top
C8  78.71,41.72 0 top
C9  76.61,34.16 0 top
C10  82.27,59.82 270 top
C11  78.78,43.07 0 top
C12  50.16,39.37 0 top
C13  11.11,12.38 270 top
C14  49.53,41.59 0 top
C15  41.59,51.12 180 top
C16  41.91,39.37 180 top
C17  42.55,41.59 180 top
C18  42.55,48.9 180 top
C19  24.45,52.7 270 top
C20  29.53,52.7 90 top
C21  11.43,16.83 180 top
C22  2.54,38.73 270 top
C23  24.45,42.55 270 top
C24  29.53,42.55 90 top
C25  11.43,61.28 90 top
C26  9.84,52.7 270 top
C27  14.92,52.7 90 top
C28  78.74,69.85 180 top
J5  88.27,38.73 270 top
J6  65.41,69.22 180 top
JP1  6.03,13.65 270 top
JP2  74.93,8.26 90 top
JP3  65.41,8.26 270 top
JP4  64.14,22.23 180 top
JP5  83.82,74.3 270 top
MH1  6.5,6.5 0 top
MH2  84.5,6.5 0 top
MH3  84.5,84.5 0 top
MH4  6.5,84.5 0 top
Q1  -1.91,-28.57 0 top  (outside the outline)
Q2  13.97,12.38 0 top
R1  68.75,57.23 90 top
R2  80.62,59.65 270 top
R3  83.02,43.21 0 top
R4  83.55,50.42 180 top
R5  83.53,49.12 180 top
R6  13.02,6.35 270 top
R7  21.91,52.7 270 top
R8  21.91,48.26 270 top
R9  26.99,48.26 270 top
R10  29.53,48.26 270 top
R11  24.45,48.26 90 top
R12  32.07,52.7 270 top
R13  21.91,42.55 270 top
R14  21.91,38.1 270 top
R15  2.54,23.18 90 top
R16  26.99,38.1 270 top
R17  29.53,38.1 270 top
R18  24.45,38.1 90 top
R19  32.07,42.55 270 top
R20  7.3,52.7 270 top
R21  7.3,48.26 270 top
R22  12.38,48.26 270 top
R23  14.92,48.26 270 top
R24  9.84,48.26 90 top
R25  17.46,52.7 270 top
R26  7.62,61.59 270 top
R27  78.74,72.39 180 top
R53  -3.17,-6.99 0 top  (outside the outline)
R54  -3.17,-12.06 0 top  (outside the outline)
R55  -3.17,-17.14 0 top  (outside the outline)
R56  -3.17,-22.23 0 top  (outside the outline)
S1  80.64,67.31 270 top
S2  80.64,57.15 270 top
SJ1  7.3,17.46 90 top
TP6  21.91,9.21 0 top
TP7  18.1,59.69 90 top
U1  67.94,44.45 180 top
U2  26.99,52.7 0 top
U3  46.04,45.09 0 top
U4  26.99,42.55 0 top
U5  14.61,61.28 90 top
U6  12.38,52.7 0 top
Y1  61.21,57.15 90 top
Y2  78.93,46.28 270 top

### Tracks (layer width: path | path; a pad name or v marks a point on that pad's centre or on a via)
!CS!_HMC1053
  Top 0.203: U3.15 51.75,46.67 56.73,41.7 U1.36
!CS!_MTI
  Top 0.203: U1.27 59.48,46.2 59.32,46.04 56.36,46.04 55.92,46.48 55.92,47.83 55.24,48.5 55.24,59.69 59.69,64.14 65.41,64.14 66.67,65.41 66.67,72.39 69.85,75.56 71.75,75.56 J6.9
!CS!_SUN_X+
  Top 0.203: U1.48 66.69,36.83 65.73,35.87 65.72,35.86 65.41,35.54 65.41,31.75 66.67,30.48 70.48,30.48 71.75,29.21 71.75,14.61 73.03,13.34 JP2.10
!CS!_SUN_X-  (via drill 0.35)  (1 unrouted)
  Top 0.203: U1.59 72.19,36.71 v73.03,35.88
  Bottom 0.203: v73.03,35.88 73.03,28.89 v72.71,28.57
!CS!_SUN_Y+  (via drill 0.35)  (1 unrouted)
  Top 0.203: U1.35 60.35,42.2 60.01,42.55 v59.37,42.55
  Bottom 0.203: v59.69,35.56 59.05,36.2 59.05,42.23 v59.37,42.55
!CS!_SUN_Y-  (via drill 0.35)  (1 unrouted)
  Top 0.203: U1.58 71.69,36.77 v71.12,36.2
  Bottom 0.203: v71.12,36.2 71.12,34.61 v70.17,33.66
!CS!_SUN_Z+  (via drill 0.35)
  Top 0.203: U1.32 59.8,43.7 v59.69,43.81
  Bottom 0.203: v59.69,43.81 58.16,43.81 57.78,43.44 57.78,34.92 v58.42,34.29
!CS!_SUN_Z-  (1 unrouted)
  Top 0.203: U1.56 70.69,38.45 70.42,38.73 61.91,38.73 60.96,37.78
+3V3  (via drill 0.3 pad 0.66, 0.35)  (1 unrouted)
  Top 0.203: v24.45,54.64 C19.1 24.51,53.62 U2.5 | v24.45,44.48 C23.1 24.51,43.45 U4.5 | R13.1 v21.91,44.77 | v9.84,54.64 C26.1 9.9,53.62 U6.5 | R20.1 v7.3,54.93 | 56.64,52.67 C2.+ | U1.50 67.69,35.22 C7.1 v67.95,33.98 v67.94,33.97 | U3.7 U3.8 43.48,41.68 C17.1 43.4,39.45 C16.1 43.31,37.63 v43.47,37.47 | v11.43,63.21 C25.2 12.17,62.13 12.37,61.93 U5.4 13.76,61.98 | C15.1 43.5,50.61 | C12.1 48.6,39.21 | C12.1 48.68,39.45 C14.1 48.68,42.77 U3.9 | 2.64,39.69 C22.1 3.6,39.59 3.81,39.37 A1.1 | v21.91,54.93 R7.1 | R6.2 v13.02,3.5 | R27.1 v80.97,72.39 | R1.2 v68.75,58.61 | C15.1 42.99,50.03 43.4,49.63 C18.1 43.4,47.4 U3.1 | C12.1 48.77,37.59 v48.9,37.47 | C15.1 42.99,52.52 v43.18,52.7
  Top 0.254: 67.69,35.27 C7.1 67.95,34.92 68,34.92 | 64.19,52.85 64.19,53.05 | U1.18 64.19,52.8
  Top 0.305: 64.19,52.85 C3.2 | v84.81,43.48 84.81,41.58 84.8,41.57 85.72,40.64 88.9,40.64 89.75,39.78 89.75,35.15 J5.3 | S2.1 79.12,55.63 79.12,51.37 v81.92,48.58 | S2.1 | 64.19,52.8 C3.2 | R2.2 80.62,57.18 S2.1 | C3.2 64.12,53.35 63.82,53.66 58.42,53.66 57.93,53.17 C2.+
  Bottom 0.305: v84.81,43.48 84.81,44.36 81.92,47.26 v81.92,48.58
  pour PWR (rank 6, no thermals): -4.45,93.98 -4.45,-3.81 95.25,-3.81 95.25,92.71 95.25,93.98
+5V  (3 unrouted)
  Top 0.254: 77.98,37.38 77.83,37.54 74.78,37.54 73.18,39.14 73.18,41.12 73.75,41.7 U1.65
  Top 0.305: 77.83,37.54 86.92,37.54 J5.2 | C9.+ 77.98,37.38
ACT_BRD_3V_PRESENT  (1 unrouted)
ACT_BRD_5V_PRESENT  (1 unrouted)
ACT_BRD_5V_SHIFTED  (2 unrouted)
AVCC1
  Top 0.203: R1.1 68.76,56.56 68.76,56.03 68.01,55.28 C1.1 67.69,55.27 U1.11
  Top 0.305: 67.69,55.26 C1.1
B_MEAS_X  (1 unrouted)
  Top 0.203: 27.68,43.49 C24.2 R19.1 | R19.1 31.75,43.81 | R19.1 33.34,43.49 34.61,44.77 U3.5
B_MEAS_Y
  Top 0.203: U2.4 27.68,53.66 C20.2 R12.1 33.34,53.66 34.61,52.39 34.61,49.85 39.05,45.4 U3.4
B_MEAS_Z  (1 unrouted)
  Top 0.203: 13.07,53.66 C27.2 R25.1 19.05,53.66 20.8,55.4 20.95,55.56 | U3.3 40.32,46.04 36.2,50.16 36.2,54.61 34.92,55.88 21.27,55.88 20.95,55.56 | 20.95,55.56
BRD_TEMP_MEAS
  Top 0.203: 16.52,61.93 U5.3 17,61.93 18.1,60.83 TP7.TP | TP7.TP 17.78,59.37 | U3.2 40.96,46.67 37.47,50.16 37.47,55.24 36.2,56.52 20.32,56.52 18.1,58.74 TP7.TP
GND  (via drill 0.3 pad 0.66, 0.35)  (7 unrouted)
  Top 0.203: C19.2 v24.45,50.77 | R8.2 v21.91,46.04 | C23.2 v24.45,40.61 | R14.2 v21.91,35.88 | C26.2 v9.84,50.77 | R21.2 v7.3,46.04 | 79.44,43.05 C11.2 80.21,43.07 v80.33,43.18 | 79.4,41.68 C8.2 80.2,41.72 v80.33,41.59 | R5.1 v85.06,49.12 | 56.94,50.42 C2.- v56.63,48.9 | U1.19 63.7,51.88 63.5,52.07 v62.23,52.07 | U3.6 v42.05,44.13 | C17.2 v40.61,41.59 | v51.46,41.59 C14.2 | C18.2 v40.61,48.9 | C16.2 40.35,39.37 | 40.35,39.37 | 40.35,39.37 v39.08,39.37 | U5.2 v16.75,61.28 | v12.62,60.64 13.69,60.64 U5.5 | C25.1 v11.43,59.35 | C15.2 v38.76,51.12 | v53,39.37 C12.2 | 79.03,46.38 Y2.2 79.01,46.35 v80.96,46.35 | U1.49 67.19,36.4 v66.99,36.2 | v66.67,33.97 66.67,34.95 66.7,34.98 | U1.61 75.55,39.7 v75.88,39.37 | C22.2 v2.54,36.8 | C13.1 v11.11,14.31 | Q2.3 v14.29,11.67 | R15.1 v2.54,20.32 | C28.1 v80.97,69.85 | C6.1 v57.99,51.27 | C9.- v73.73,34.16 | U3.10 U3.11 49.85,44.13 v50.16,43.81 | R26.1 v7.62,64.45
  Top 0.254: C7.2 66.75,34.98 66.7,34.98 | C3.1 v61.99,52.87
  Top 0.305: C10.2 v82.27,58.29
  other vias: 76.23,45.26 76.23,46.41 60.96,59.05 59.37,58.74 58.1,58.74 57.78,57.15 58.1,55.24 59.69,55.56 61.28,55.24 66.55,53.98 62.87,57.15 66.67,58.9
  pour Top (isolate 0.203): 67.69,50.27 67.69,59.05 66.93,59.84 58.06,59.87 57.1,58.95 57.1,55.22 58.01,54.28 64.82,54.28 66.19,52.91 66.19,50.27
  pour Top (isolate 0.203): 73.79,43.18 77.09,43.15 77.67,43.74 80.21,43.76 80.98,44.53 80.98,48.11 80.31,48.77 77.52,48.77 76.78,48.03 76.78,45.03 76.48,44.73 73.79,44.73
  pour GND (no thermals): -0.64,92.08 92.08,92.08 92.08,-0.64 -0.64,-0.64
HMC1053_RESET  (via drill 0.35)  (2 unrouted)
  Top 0.203: Q2.4 14.95,9.53 14.63,9.21 13.96,9.21 13.64,9.53 Q2.2 | 61.09,38.42 61.77,39.09 62.27,39.09 65.41,42.23 v65.41,44.45 | U1.1 72.69,52.69 v72.71,52.7
  Bottom 0.203: v65.41,44.45 72.71,51.75 v72.71,52.7
INIT_EPS_BURN_WIRE  (via drill 0.35)
  Top 0.203: U1.54 69.69,36.35 v69.85,36.2
  Bottom 0.203: JP5.3 81.28,75.56 59.69,75.56 56.52,72.39 56.52,55.24 62.87,48.9 62.87,40.64 67.94,40.64 69.85,38.73 v69.85,36.2
MAG_X_RIN  (via drill 0.35)
  Top 0.203: U1.34 60.35,42.7 59.88,43.18 59.05,43.18 v58.42,43.18
  Bottom 0.203: v58.42,43.18 v58.42,35.56
MAG_Y_FIN  (via drill 0.35)
  Top 0.203: U1.29 59.89,45.2 v59.69,45.4
  Bottom 0.203: v59.69,45.4 58.16,45.4 56.83,44.07 56.83,34.92 56.52,34.92 v55.88,34.29 55.88,16.51 JP3.6
MAG_Y_RIN  (via drill 0.35)  (1 unrouted)
  Top 0.203: U1.30 59.12,44.7 v59.05,44.77
  Bottom 0.203: v59.05,44.77 58.61,44.77 57.43,43.59 57.43,34.57 v57.15,34.29
MAG_Z_FIN  (via drill 0.35)  (2 unrouted)
  Top 0.203: v56.83,46.99 58.1,46.99 58.42,47.3 59.32,47.3 59.42,47.2 U1.25
MAG_Z_RIN  (via drill 0.35)  (2 unrouted)
  Top 0.203: U1.26 61.29,46.67 v59.05,46.67
  Bottom 0.203: v59.05,46.67 58.14,45.76 58.01,45.76
MTI_DRDY  (via drill 0.35)
  Top 0.203: U1.57 71.19,39.61 v69.22,41.59 | v73.03,48.26 73.03,49.68 73.66,50.32 v73.66,52.7
  Bottom 0.203: v69.22,41.59 69.22,44.45 v73.03,48.26 | J6.22 64.14,73.03 64.14,64.77 73.66,55.24 v73.66,52.7
N$7
  Top 0.203: R27.2 C28.2 77.75,69.96 75.04,69.96 74.3,69.22 J6.5
N$12
  Top 0.203: S2.2 83.11,52.15 84.05,51.2 R4.1
N$20
  Top 0.203: 24.45,47.63 R11.1 23.49,47.31 23.18,47.62 23.18,48.9 22.87,49.21 R8.1 R7.2
N$21  (1 unrouted)
  Top 0.203: C20.1 27.68,51.76 | C20.1 R12.2 | R10.1 C20.1
N$23
  Top 0.203: R11.2 R9.1 26.99,49.94 26.34,50.59 U2.1
N$35
  Top 0.203: C21.2 7.43,16.83 SJ1.1 JP1.2
N$36
  Top 0.203: A1.2 A1.15 | A1.7 4.45,24.13 3.81,24.77 2.71,24.77 R15.2
  Bottom 0.203: A1.7 3.81,26.04 3.81,34.92 A1.2
N$37
  Top 0.203: A1.3 5.08,34.29 4.45,33.66 4.45,27.94 A1.6 7.3,25.08 SJ1.2 5.84,18.22 4.76,17.14 JP1.1
N$38  (2 unrouted)
  Top 0.203: Q2.5 Q2.8 12.99,16.66 C21.1
N$39
  Top 0.203: C13.2 11.11,10.58 11.43,10.27 Q2.1 13.02,10.24 R6.1 13.36,8.23
N$40
  Top 0.203: R26.2 9.04,60.17 10.79,58.42 14.92,58.42 15.51,59 U5.1
N$49
  Top 0.203: 24.45,37.47 R18.1 23.49,37.15 23.18,37.47 23.18,38.74 22.87,39.05 R14.1 R13.2
N$50  (1 unrouted)
  Top 0.203: R19.2 C24.1 | C24.1 27.68,41.59 | C24.1 R17.1
N$52
  Top 0.203: R18.2 R16.1 26.99,39.78 26.34,40.43 U4.1
N$59
  Top 0.203: 9.84,47.63 R24.1 8.89,47.31 8.57,47.62 8.57,48.9 8.26,49.21 R21.1 R20.2
N$60  (1 unrouted)
  Top 0.203: 13.07,51.76 C27.1 | C27.1 R25.2 | C27.1 R23.1
N$62
  Top 0.203: R24.2 R22.1 12.38,49.94 11.73,50.59 U6.1
OUT_A_N  (via drill 0.35)
  Top 0.203: R9.2 v26.99,46.03
  Bottom 0.203: A1.10 17.14,27.94 17.14,41.27 19.05,43.18 26.67,43.18 26.99,43.5 v26.99,46.03
OUT_A_P
  Top 0.203: R10.2 29.53,46.04 | 29.53,46.04 29.53,46.03 | 29.53,46.04 28.89,45.4 27.25,45.4 26.73,45.4 26.72,45.4 26.04,45.4 19.36,45.4 A1.16
OUT_B_N
  Top 0.203: A1.4 6.99,30.48 16.19,30.48 19.68,30.48 20.95,31.75 24.77,31.75 26.99,33.97 R16.2
OUT_B_P
  Top 0.203: 14.3,29.21 A1.12 24.77,29.21 29.53,33.97 R17.2
OUT_C_N  (via drill 0.35)
  Top 0.203: v10.79,38.1 10.79,44.45 12.38,46.04 R22.2
  Bottom 0.203: A1.9 10.79,24.13 v10.79,38.1
OUT_C_P
  Top 0.203: R23.2 14.92,46.04 12.06,43.18 12.06,38.73 12.7,38.1 13.97,38.1 14.61,37.47 14.61,33.02 A1.13
P1.7/CTS  (via drill 0.35)
  Top 0.203: J5.5 79.06,28.57 v76.83,30.8 | U1.28 66.06,45.7 v75.56,36.2
  Bottom 0.203: v76.83,30.8 76.83,34.92 v75.56,36.2
P4.4/UCA1TXD
  Top 0.203: J5.7 81.64,23.5 70.03,35.1 69.04,35.1 68.19,35.95 U1.51
P4.5/UCA1RXD
  Top 0.203: J5.6 79.89,26.04 70.42,35.5 69.28,35.5 68.69,36.08 U1.52
P5.2/XT2IN1
  Top 0.203: Y2.3 77.78,44.78 76.69,43.7 U1.69
P5.3/XT2OUT1
  Top 0.203: Y2.1 77.88,47.78 77.32,47.22 77.32,45.03 76.48,44.2 75.56,44.2 74.77,44.2 U1.70
P5.4/XIN1
  Top 0.203: C4.2 64.39,58.88 Y1.P2 66.36,57.62 66.75,57.23 66.75,54.74 67.19,54.29 U1.12
P5.5/XOUT1  (1 unrouted)
  Top 0.203: C5.2 64.4,55.44 Y1.P1 | Y1.P1 65.64,56.63 | 66.7,51.28 66.7,52.7 65.84,53.57 65.84,56.49 Y1.P1
P6.7/RTS  (via drill 0.35)
  Top 0.203: J5.4 78.42,31.11 77.15,32.38 v74.61,32.38 | U1.4 71.19,44.38 v73.03,42.55
  Bottom 0.203: v73.03,42.55 73.66,41.91 73.66,35.88 74.61,34.92 v74.61,32.38
PAYLOAD_MISO  (1 unrouted)
PAYLOAD_MOSI  (1 unrouted)
PAYLOAD_SCL  (1 unrouted)
PAYLOAD_SCLK  (1 unrouted)
PAYLOAD_SDA  (1 unrouted)
RST/SBWTDIO  (via drill 0.35)  (1 unrouted)
  Top 0.203: 80.63,60.05 R2.1 | v72.07,45.4 72.39,45.72 72.39,46.35 73.23,47.2 U1.76 76.09,47.2 76.52,47.62 76.52,57.78 78.88,60.15 R2.1 | v71.75,32.07 82.87,20.95 J5.8 | R2.1 80.62,62.28 S1.2 | C10.1 81.64,60.42 81.32,60.1 80.67,60.1 R2.1
  Bottom 0.203: v72.07,45.4 71.75,45.09 v71.75,32.07
SEN_BRD_5V_PRESENT  (2 unrouted)
TARGET_DP
  Top 0.203: R3.2 83.52,42.24 81.47,40.2 U1.62
TARGET_PUR
  Top 0.203: R4.2 83.03,50.39 R5.2 83.03,45.09 82.52,44.58 R3.1 82.52,42.2 81.02,40.7 U1.63
TARGET_VUSB1
  Top 0.203: C8.1 77.64,42.2 U1.66
TEST/SBWTCK  (via drill 0.35)
  Top 0.203: J5.9 84.14,18.41 v72.39,30.16 | v72.71,44.45 72.96,44.7 U1.71
  Bottom 0.203: v72.71,44.45 72.39,44.13 v72.39,30.16
UCA0RXD
  Top 0.203: 63.18,37.45 63.2,37.47 U1.41 63.2,36.52 59.05,32.38 59.05,22.23 JP4.12
UCA0TXD  (via drill 0.35)
  Top 0.203: 61.33,39.69 U1.40 60.02,39.7 v59.69,39.37 | v59.69,36.83 60.33,36.2 60.33,34.92 57.78,32.38 JP4.11
  Bottom 0.203: v59.69,39.37 v59.69,36.83
UCB0_SPI_CLK  (2 unrouted)
  Top 0.203: U1.39 55.76,40.2 | J6.12 69.22,80.64 60.96,80.64 59.05,78.74 59.05,64 54.89,59.84 54.89,49.49 52.7,47.31 U3.16
UCB0_SPI_MISO  (via drill 0.35)  (1 unrouted)
  Top 0.203: v69.22,52.7 71.75,55.24 71.75,69.85 72.39,70.48 73.66,70.48 74.3,71.12 74.3,75.56 J6.11 | v64.14,44.13 64.14,41.91 62.92,40.7 U1.38 56.72,40.7 52.65,44.77 U3.12
  Bottom 0.203: v64.14,44.13 64.14,47.62 v69.22,52.7
UCB0_SPI_MOSI  (via drill 0.35)  (1 unrouted)
  Top 0.203: v63.5,42.55 63.5,41.91 62.79,41.2 U1.37 56.72,41.2 51.88,46.04 U3.14 | J6.10 69.22,73.03 69.22,60.96 71.12,59.05 v71.12,55.88
  Bottom 0.203: v71.12,55.88 71.12,51.44 64.77,45.09 64.77,43.81 v63.5,42.55
V1
  Top 0.203: 77.81,42.7 C11.1 77.81,42.7 U1.67
VCORE1  (1 unrouted)
  Top 0.305: C6.2 63.19,51.27

### Text on the board
tDocu: LORIS ADCS SENSOR BOARD - REV A | Designed by T. Christison | U4 | U2 | U6 | RST | BSL | GND | 5V | 3V3 | RTS>> | CTS<< | RXD<< | TXD>> | SBWRST | SBWTST
_tDocu: Dalhousie Space Systems Lab